# EAGLE schematic openadc_ztex (EAGLE 6.5.0)
Assembly variants: no-adc

## Sheet 1 of 8
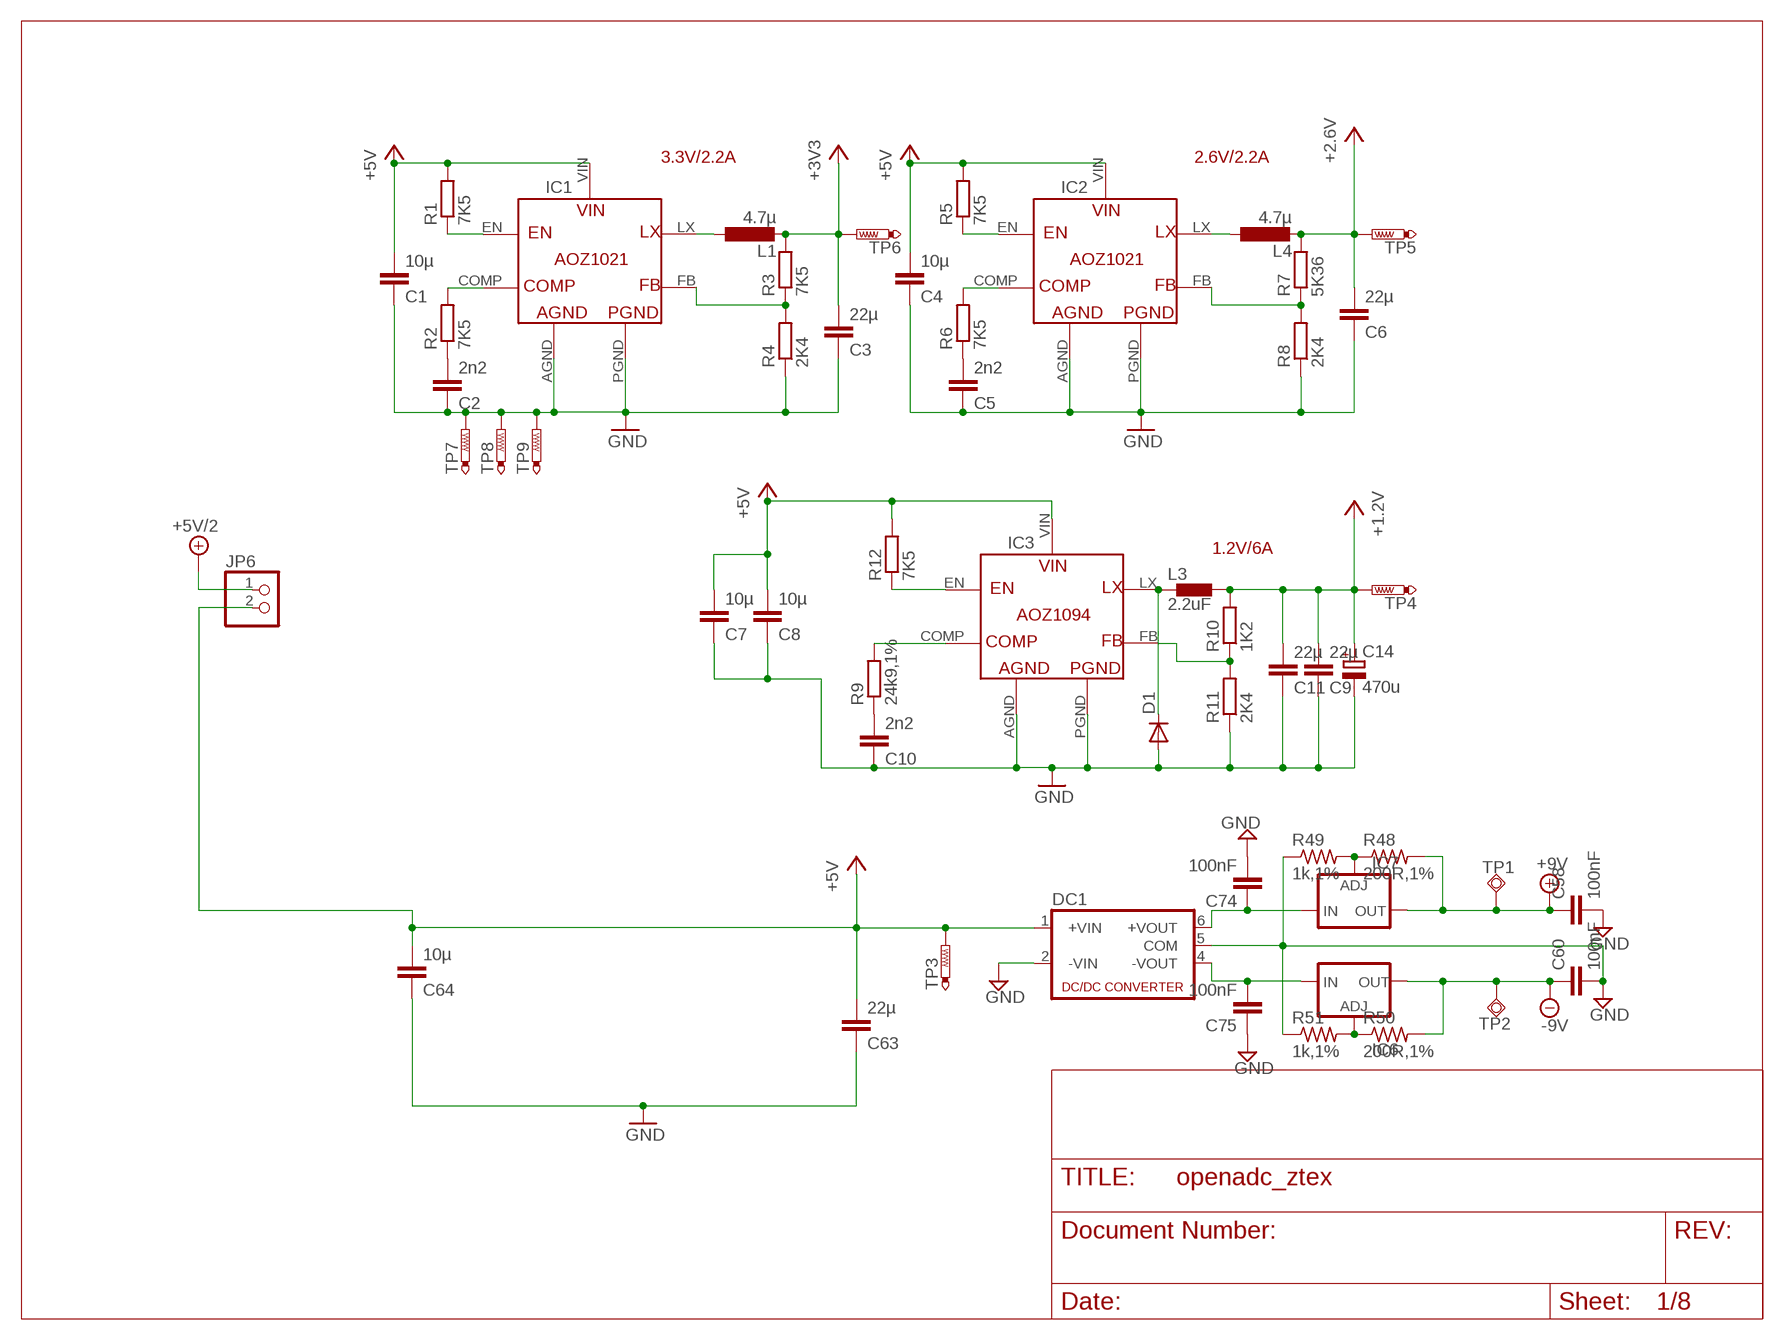
[diagram p0: schematic, sheet 1]

### Parts
C1  10µ  C-EUC1206  [C1206]
C2  2n2  C-EUC0805K  [C0805K]
C3  22µ  C-EUC0805K  [C0805K]
C4  10µ  C-EUC1206  [C1206]
C5  2n2  C-EUC0805K  [C0805K]
C6  22µ  C-EUC0805K  [C0805K]
C7  10µ  C-EUC1206  [C1206]
C8  10µ  C-EUC1206  [C1206]
C9  22µ  C-EUC0805K  [C0805K]
C10  2n2  C-EUC0805K  [C0805K]
C11  22µ  C-EUC0805K  [C0805K]
C14  470u  CPOL-EUE2.5-6  [E2,5-6]
C58  100nF  C-EUC0603  [C0603]
C60  100nF  C-EUC0603  [C0603]
C63  22µ  C-EUC0805K  [C0805K]
C64  10µ  C-EUC1206  [C1206]
C74  100nF  C-EUC0603  [C0603]
C75  100nF  C-EUC0603  [C0603]
D1  DIODE-MELF-MLL41  [MELF-MLL41]
DC1  NMA  [NMA]
IC1  AOZ1021  [AOZ1021]
IC2  AOZ1021  [AOZ1021]
IC3  AOZ1094  [AOZ1094.PAC]
IC6  LM337L  [337L]
IC7  LM317L  [317L]
JP6  PINHD-1X2  [1X02]
L1  4.7µ  L-EUNR60  [NR60]
L3  2.2uF  DR1030FAKE  [DR1030MOD.PAC]
L4  4.7µ  L-EUNR60  [NR60]
R1  7K5  R-EU_R0805K  [R0805K]
R2  7K5  R-EU_R0805K  [R0805K]
R3  7K5  R-EU_R0805K  [R0805K]
R4  2K4  R-EU_R0805K  [R0805K]
R5  7K5  R-EU_R0805K  [R0805K]
R6  7K5  R-EU_R0805K  [R0805K]
R7  5K36  R-EU_R0805K  [R0805K]
R8  2K4  R-EU_R0805K  [R0805K]
R9  24k9,1%  R-EU_R0805K  [R0805K]
R10  1K2  R-EU_R0805K  [R0805K]
R11  2K4  R-EU_R0805K  [R0805K]
R12  7K5  R-EU_R0805K  [R0805K]
R48  200R,1%  R-US_R0603  [R0603]
R49  1k,1%  R-US_R0603  [R0603]
R50  200R,1%  R-US_R0603  [R0603]
R51  1k,1%  R-US_R0603  [R0603]
TP1  TPSQPAD1-13  [P1-13]  (not fitted in variant no-adc)
TP2  TPSQPAD1-13  [P1-13]  (not fitted in variant no-adc)
TP3  PTR1PAD1-13  [P1-13]  (not fitted in variant no-adc)
TP4  PTR1PAD1-13  [P1-13]  (not fitted in variant no-adc)
TP5  PTR1PAD1-13  [P1-13]  (not fitted in variant no-adc)
TP6  PTR1PAD1-13  [P1-13]  (not fitted in variant no-adc)
TP7  PTR1PAD1-13  [P1-13]
TP8  PTR1PAD1-13  [P1-13]
TP9  PTR1PAD1-13  [P1-13]  (not fitted in variant no-adc)

### Nets
+1.2V [xpower]: C9.2 C11.2 C14.+ L3.2 R10.2 TP4.TP ; also sheet 2
+2.6V [power]: C6.2 L4.P$2 R7.2 TP5.TP ; also sheet 2
+3V3 [power]: C3.2 L1.P$2 R3.2 TP6.TP ; also sheet 2,3,5,6,7,8
+5V: C1.2 C4.2 C7.2 C8.2 C63.2 C64.2 DC1.1(+VIN) IC1.VIN IC2.VIN IC3.VIN JP6.2 R1.2 R5.2 R12.2 TP3.TP ; also sheet 2,7,8
+5V/2: JP6.1 ; also sheet 4,7
+9V: C58.1 IC7.2(OUT) R48.2 TP1.TP ; also sheet 7
-9V: C60.1 IC6.OUT R50.2 TP2.TP ; also sheet 7
GND [power]: C1.1 C2.1 C3.1 C4.1 C5.1 C6.1 C7.1 C8.1 C9.1 C10.1 C11.1 C14.- C58.2 C60.2 C63.1 C64.1 C74.2 C75.1 D1.A DC1.2(-VIN) DC1.5(COM) IC1.AGND IC1.PGND IC2.AGND IC2.PGND IC3.AGND IC3.PGND R4.1 R8.1 R11.1 R49.1 R51.1 TP7.TP TP8.TP TP9.TP ; also sheet 2,3,4,5,6,7,8
N$2: IC3.EN R12.1
N$3 [power]: IC1.LX L1.P$1
N$4: IC1.FB R3.1 R4.2
N$5: D1.C IC3.LX L3.1
N$10: IC1.EN R1.1
N$14 [power]: IC3.FB R10.1 R11.2
N$17: C2.2 R2.1
N$33: IC1.COMP R2.2
N$36: C10.2 R9.1
N$37: IC3.COMP R9.2
N$38 [power]: IC2.LX L4.P$1
N$39: IC2.FB R7.1 R8.2
N$41: IC2.EN R5.1
N$42: C5.2 R6.1
N$43: IC2.COMP R6.2
N$82: C74.1 DC1.6(+VOUT) IC7.3(IN)
N$99: C75.2 DC1.4(-VOUT) IC6.IN
N$108: IC6.ADJ R50.1 R51.2
N$109: IC7.1(ADJ) R48.1 R49.2

### Notes on the sheet
- 3.3V/2.2A | 2.6V/2.2A
- 1.2V/6A

## Sheet 2 of 8
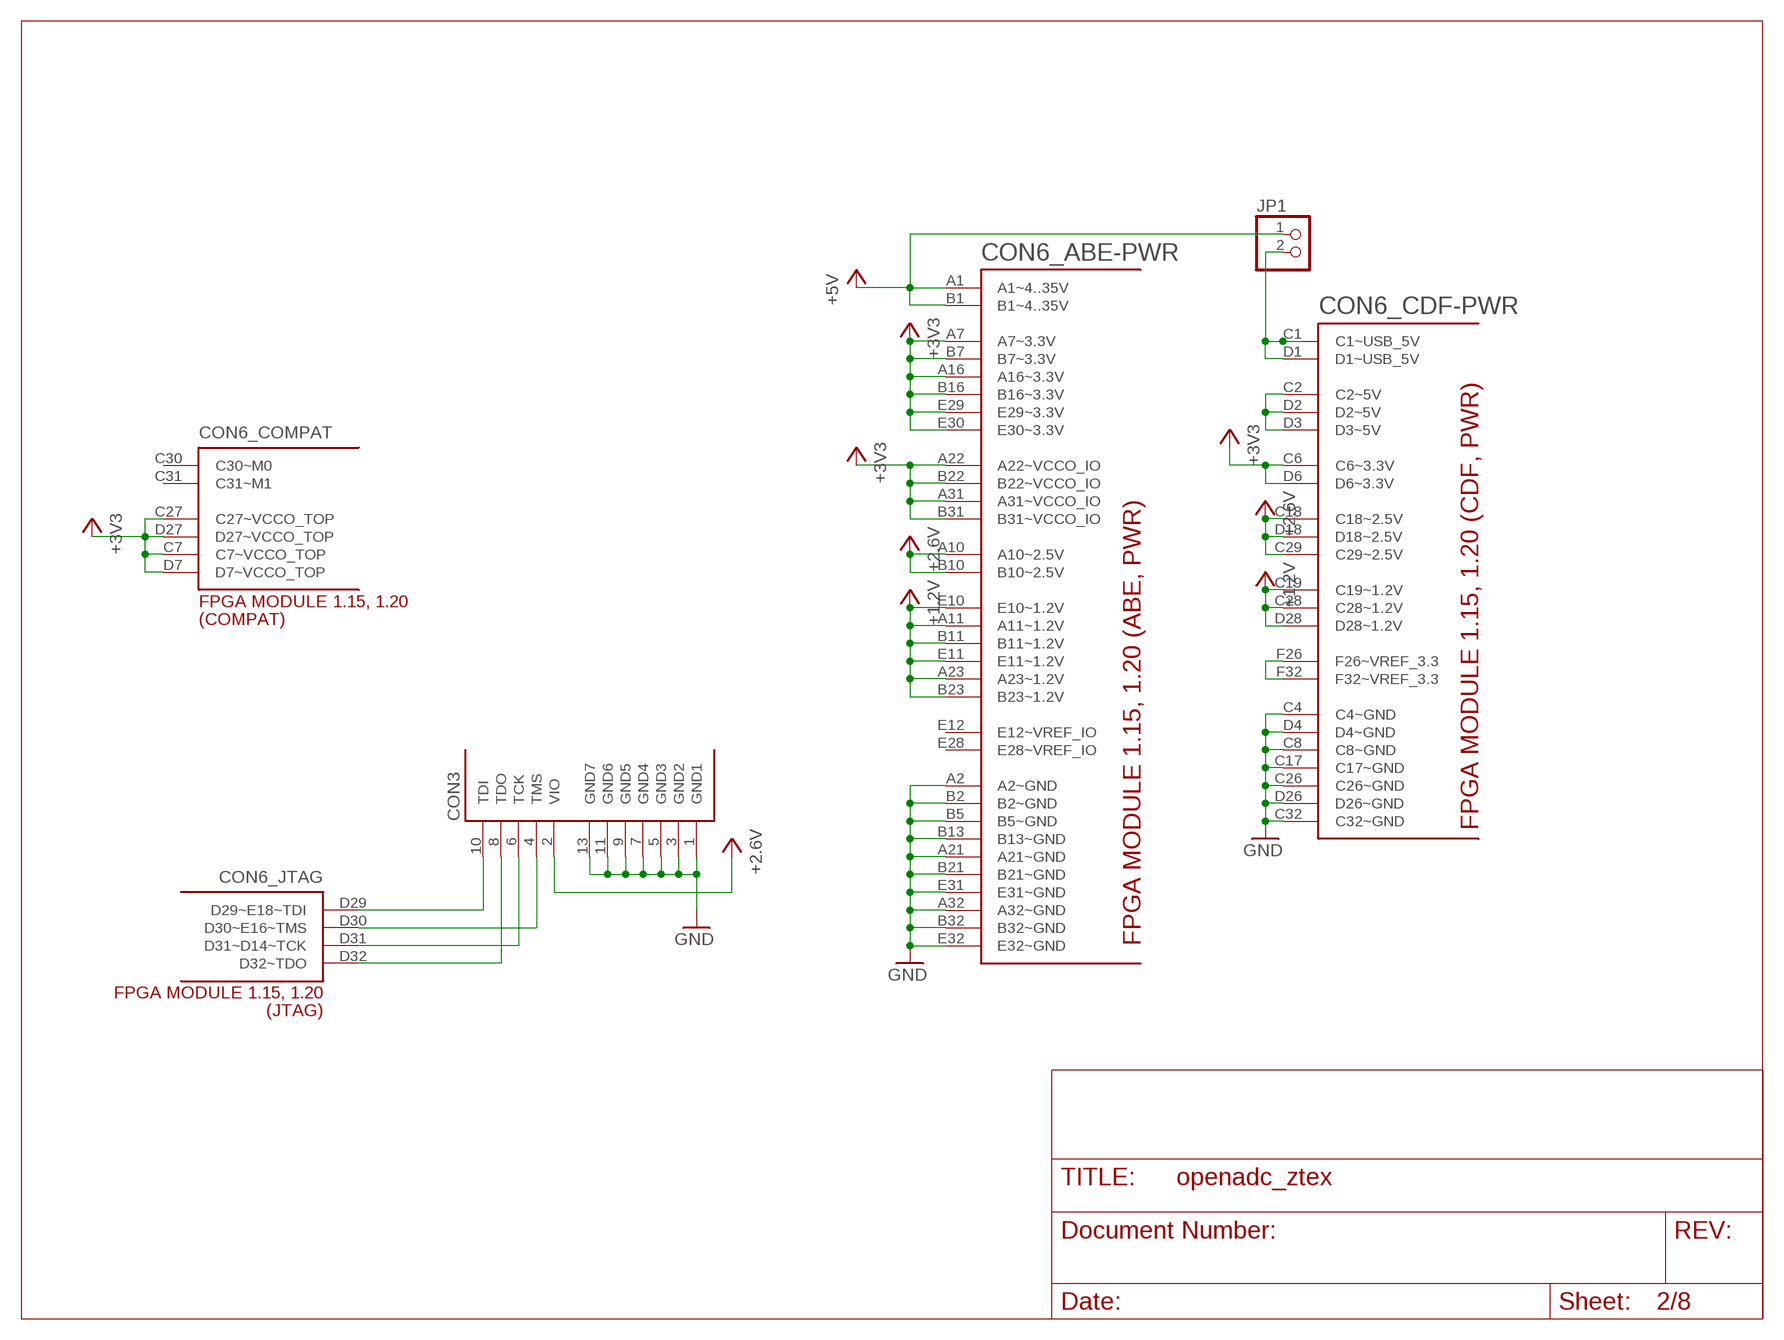
[diagram p1: schematic, sheet 2]

### Parts
CON3  JTAG  [JTAG]
CON6  USB-FPGA1.15  [USB-FPGA1.15]
JP1  PINHD-1X2  [1X02]

### Nets
+1.2V [xpower]: CON6.A11(_ABE-PWR:A11~1.2V) CON6.A23(_ABE-PWR:A23~1.2V) CON6.B11(_ABE-PWR:B11~1.2V) CON6.B23(_ABE-PWR:B23~1.2V) CON6.C19(_CDF-PWR:C19~1.2V) CON6.C28(_CDF-PWR:C28~1.2V) CON6.D28(_CDF-PWR:D28~1.2V) CON6.E10(_ABE-PWR:E10~1.2V) CON6.E11(_ABE-PWR:E11~1.2V) ; also sheet 1
+2.6V [power]: CON3.2(VIO) CON6.A10(_ABE-PWR:A10~2.5V) CON6.B10(_ABE-PWR:B10~2.5V) CON6.C18(_CDF-PWR:C18~2.5V) CON6.C29(_CDF-PWR:C29~2.5V) CON6.D18(_CDF-PWR:D18~2.5V) ; also sheet 1
+3V3 [power]: CON6.A7(_ABE-PWR:A7~3.3V) CON6.A16(_ABE-PWR:A16~3.3V) CON6.A22(_ABE-PWR:A22~VCCO_IO) CON6.A31(_ABE-PWR:A31~VCCO_IO) CON6.B7(_ABE-PWR:B7~3.3V) CON6.B16(_ABE-PWR:B16~3.3V) CON6.B22(_ABE-PWR:B22~VCCO_IO) CON6.B31(_ABE-PWR:B31~VCCO_IO) CON6.C6(_CDF-PWR:C6~3.3V) CON6.C7(_COMPAT:C7~VCCO_TOP) CON6.C27(_COMPAT:C27~VCCO_TOP) CON6.D6(_CDF-PWR:D6~3.3V) CON6.D7(_COMPAT:D7~VCCO_TOP) CON6.D27(_COMPAT:D27~VCCO_TOP) CON6.E29(_ABE-PWR:E29~3.3V) CON6.E30(_ABE-PWR:E30~3.3V) ; also sheet 1,3,5,6,7,8
+5V: CON6.A1(_ABE-PWR:A1~4..35V) CON6.B1(_ABE-PWR:B1~4..35V) JP1.1 ; also sheet 1,7,8
GND [power]: CON3.1(GND1) CON3.3(GND2) CON3.5(GND3) CON3.7(GND4) CON3.9(GND5) CON3.11(GND6) CON3.13(GND7) CON6.A2(_ABE-PWR:A2~GND) CON6.A21(_ABE-PWR:A21~GND) CON6.A32(_ABE-PWR:A32~GND) CON6.B2(_ABE-PWR:B2~GND) CON6.B5(_ABE-PWR:B5~GND) CON6.B13(_ABE-PWR:B13~GND) CON6.B21(_ABE-PWR:B21~GND) CON6.B32(_ABE-PWR:B32~GND) CON6.C4(_CDF-PWR:C4~GND) CON6.C8(_CDF-PWR:C8~GND) CON6.C17(_CDF-PWR:C17~GND) CON6.C26(_CDF-PWR:C26~GND) CON6.C32(_CDF-PWR:C32~GND) CON6.D4(_CDF-PWR:D4~GND) CON6.D26(_CDF-PWR:D26~GND) CON6.E31(_ABE-PWR:E31~GND) CON6.E32(_ABE-PWR:E32~GND) ; also sheet 1,3,4,5,6,7,8
N$13: CON6.C1(_CDF-PWR:C1~USB_5V) CON6.D1(_CDF-PWR:D1~USB_5V) JP1.2
N$15: CON6.C2(_CDF-PWR:C2~5V) CON6.D2(_CDF-PWR:D2~5V) CON6.D3(_CDF-PWR:D3~5V)
N$20: CON6.F26(_CDF-PWR:F26~VREF_3.3) CON6.F32(_CDF-PWR:F32~VREF_3.3)
N$23: CON3.8(TDO) CON6.D32(_JTAG:D32~TDO)
N$24: CON3.10(TDI) CON6.D29(_JTAG:D29~E18~TDI)
N$25: CON3.6(TCK) CON6.D31(_JTAG:D31~D14~TCK)
N$26: CON3.4(TMS) CON6.D30(_JTAG:D30~E16~TMS)
Unconnected: CON6.A3(_ABE-FX2:A3~INT4) CON6.A4(_ABE-FX2:A4~T1) CON6.A5(_ABE-FX2:A5~BKPT) CON6.A6(_ABE-FX2:A6~SCL) CON6.A8(_ABE-FX2:A8~TXD0) CON6.B3(_ABE-FX2:B3~T0) CON6.B4(_ABE-FX2:B4~T2) CON6.B6(_ABE-FX2:B6~SDA) CON6.B8(_ABE-FX2:B8~RXD0) CON6.C5(_CDF-FX2:C5~INT5#) CON6.C9(_CDF-FX2:C9~PE7/GPIFADR8) CON6.C10(_CDF-FX2:C10~PE6/T2EX) CON6.C11(_CDF-FX2:C11~PE5/INT6) CON6.C12(_CDF-FX2:C12~PE4/RXD1OUT) CON6.C13(_CDF-FX2:C13~PE3/RXD0OUT) CON6.C14(_CDF-FX2:C14~PE2/T2OUT) CON6.C15(_CDF-FX2:C15~PE1/T1OUT) CON6.C16(_CDF-FX2:C16~PE0/T0OUT) CON6.C30(_COMPAT:C30~M0) CON6.C31(_COMPAT:C31~M1) CON6.D5(_CDF-FX2:D5~WAKEUP*) CON6.E12(_ABE-PWR:E12~VREF_IO) CON6.E28(_ABE-PWR:E28~VREF_IO)

## Sheet 3 of 8
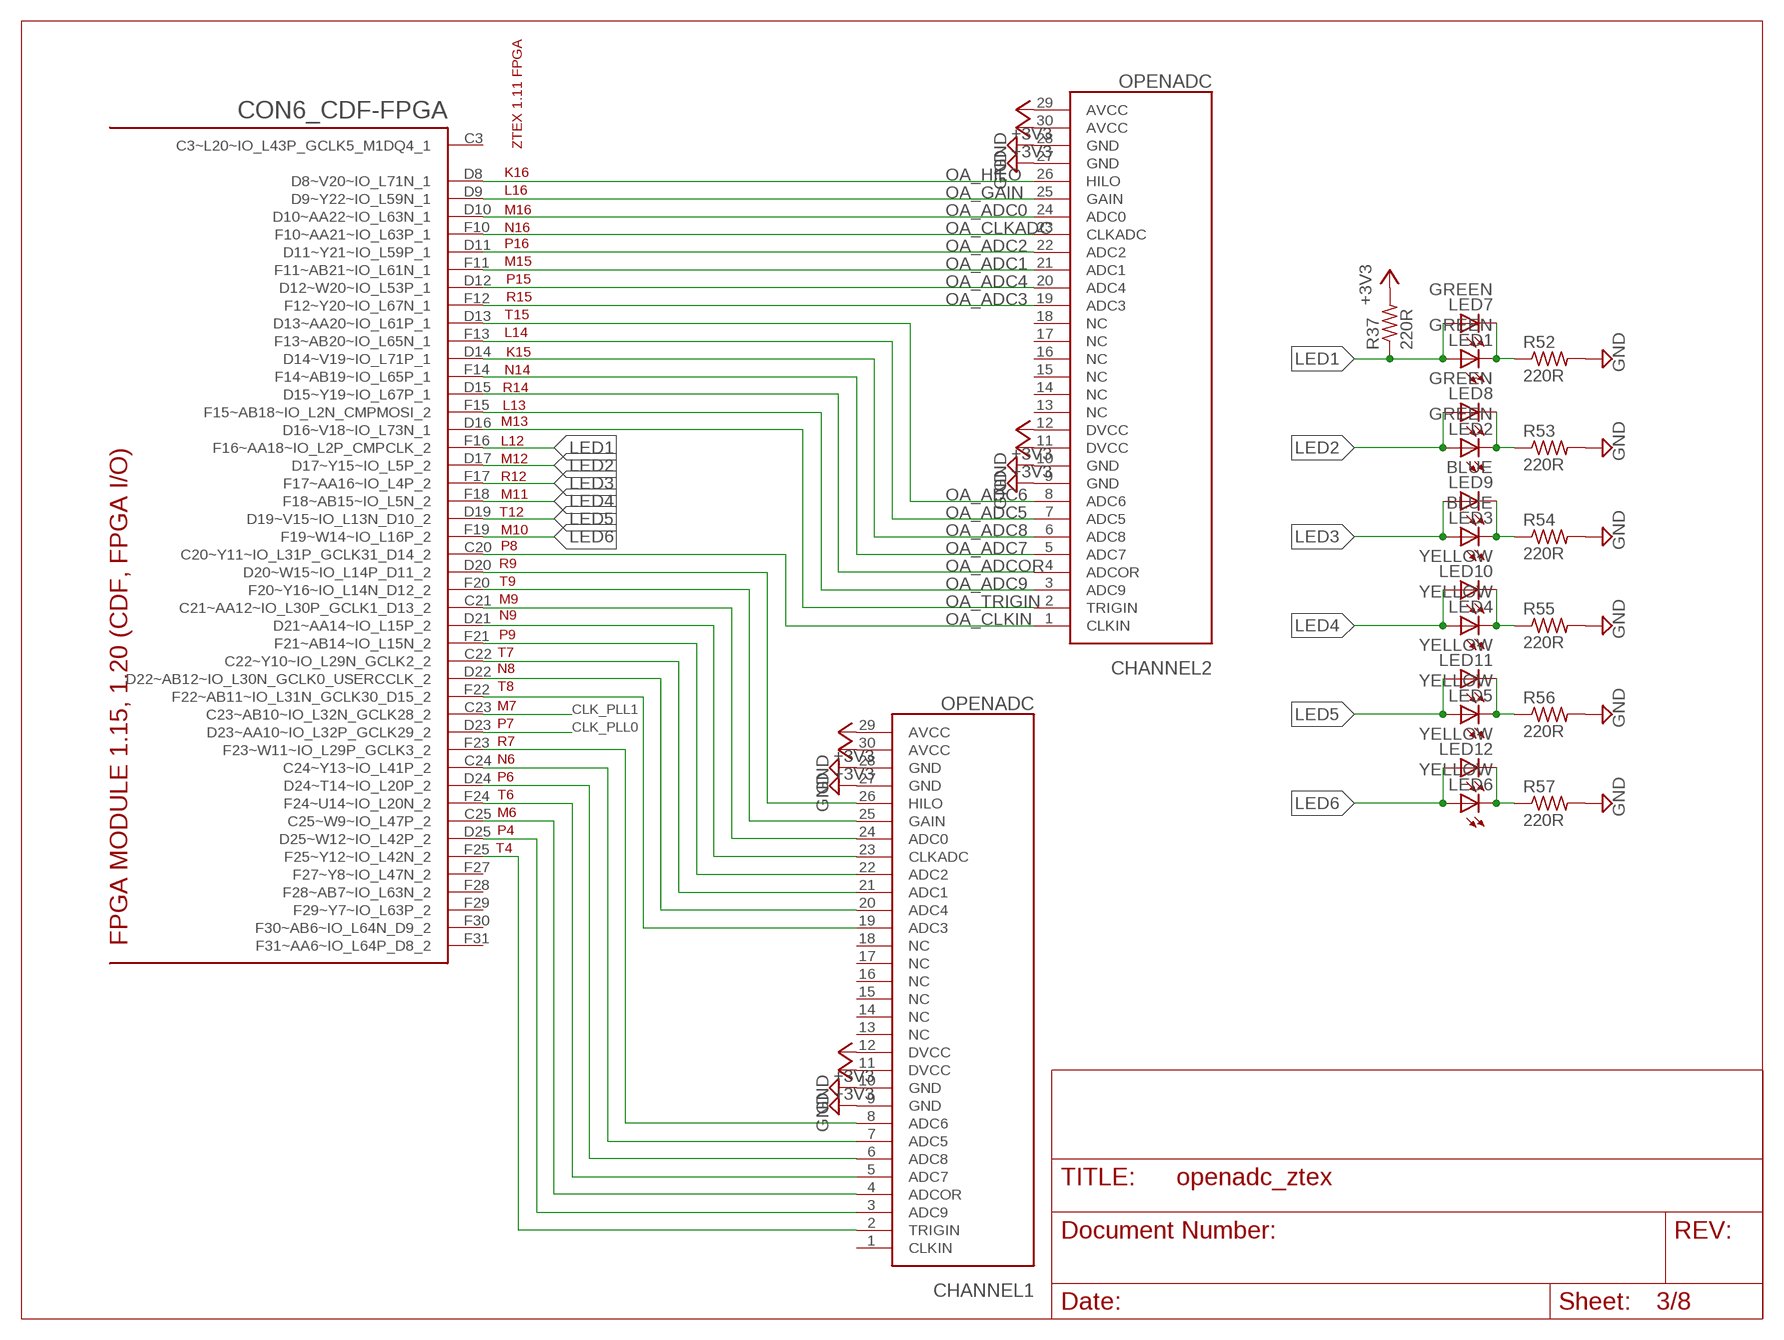
[diagram p2: schematic, sheet 3]

### Parts
CHANNEL1  OPENADC  [OPENADCREV1]
CHANNEL2  OPENADC  [OPENADCREV1]
LED1  GREEN  LED-0805  [LED-805]
LED2  GREEN  LED-0805  [LED-805]
LED3  BLUE  LED-0805  [LED-805]
LED4  YELLOW  LED-0805  [LED-805]
LED5  YELLOW  LED-0805  [LED-805]
LED6  YELLOW  LED-0805  [LED-805]
LED7  GREEN  LED-0805  [LED-805]
LED8  GREEN  LED-0805  [LED-805]
LED9  BLUE  LED-0805  [LED-805]
LED10  YELLOW  LED-0805  [LED-805]
LED11  YELLOW  LED-0805  [LED-805]
LED12  YELLOW  LED-0805  [LED-805]
R37  220R  R-US_R0603  [R0603]
R52  220R  R-US_R0603  [R0603]
R53  220R  R-US_R0603  [R0603]
R54  220R  R-US_R0603  [R0603]
R55  220R  R-US_R0603  [R0603]
R56  220R  R-US_R0603  [R0603]
R57  220R  R-US_R0603  [R0603]

### Nets
+3V3 [power]: CHANNEL1.11(DVCC) CHANNEL1.12(DVCC) CHANNEL1.29(AVCC) CHANNEL1.30(AVCC) CHANNEL2.11(DVCC) CHANNEL2.12(DVCC) CHANNEL2.29(AVCC) CHANNEL2.30(AVCC) R37.2 ; also sheet 1,2,5,6,7,8
CLK_PLL0: CON6.D23(_CDF-FPGA:D23~AA10~IO_L32P_GCLK29_2) ; also sheet 7
CLK_PLL1: CON6.C23(_CDF-FPGA:C23~AB10~IO_L32N_GCLK28_2) ; also sheet 7
GND [power]: CHANNEL1.9(GND) CHANNEL1.10(GND) CHANNEL1.27(GND) CHANNEL1.28(GND) CHANNEL2.9(GND) CHANNEL2.10(GND) CHANNEL2.27(GND) CHANNEL2.28(GND) R52.2 R53.2 R54.2 R55.2 R56.2 R57.2 ; also sheet 1,2,4,5,6,7,8
LED1: CON6.F16(_CDF-FPGA:F16~AA18~IO_L2P_CMPCLK_2) LED1.A LED7.A R37.1
LED2: CON6.D17(_CDF-FPGA:D17~Y15~IO_L5P_2) LED2.A LED8.A
LED3: CON6.F17(_CDF-FPGA:F17~AA16~IO_L4P_2) LED3.A LED9.A
LED4: CON6.F18(_CDF-FPGA:F18~AB15~IO_L5N_2) LED4.A LED10.A
LED5: CON6.D19(_CDF-FPGA:D19~V15~IO_L13N_D10_2) LED5.A LED11.A
LED6: CON6.F19(_CDF-FPGA:F19~W14~IO_L16P_2) LED6.A LED12.A
N$32: CHANNEL1.21(ADC1) CON6.C22(_CDF-FPGA:C22~Y10~IO_L29N_GCLK2_2)
N$34: CHANNEL1.26(HILO) CON6.D20(_CDF-FPGA:D20~W15~IO_L14P_D11_2)
N$35: CHANNEL1.20(ADC4) CON6.D22(_CDF-FPGA:D22~AB12~IO_L30N_GCLK0_USERCCLK_2)
N$40: CHANNEL1.25(GAIN) CON6.F20(_CDF-FPGA:F20~Y16~IO_L14N_D12_2)
N$44: CHANNEL1.24(ADC0) CON6.C21(_CDF-FPGA:C21~AA12~IO_L30P_GCLK1_D13_2)
N$45: CHANNEL1.23(CLKADC) CON6.D21(_CDF-FPGA:D21~AA14~IO_L15P_2)
N$46: CHANNEL1.22(ADC2) CON6.F21(_CDF-FPGA:F21~AB14~IO_L15N_2)
N$47: CHANNEL1.19(ADC3) CON6.F22(_CDF-FPGA:F22~AB11~IO_L31N_GCLK30_D15_2)
N$48: CHANNEL1.8(ADC6) CON6.F23(_CDF-FPGA:F23~W11~IO_L29P_GCLK3_2)
N$49: CHANNEL1.7(ADC5) CON6.C24(_CDF-FPGA:C24~Y13~IO_L41P_2)
N$50: CHANNEL1.6(ADC8) CON6.D24(_CDF-FPGA:D24~T14~IO_L20P_2)
N$51: CHANNEL1.5(ADC7) CON6.F24(_CDF-FPGA:F24~U14~IO_L20N_2)
N$52: CHANNEL1.4(ADCOR) CON6.C25(_CDF-FPGA:C25~W9~IO_L47P_2)
N$53: CHANNEL1.3(ADC9) CON6.D25(_CDF-FPGA:D25~W12~IO_L42P_2)
N$54: CHANNEL1.2(TRIGIN) CON6.F25(_CDF-FPGA:F25~Y12~IO_L42N_2)
N$110: LED1.C LED7.C R52.1
N$111: LED2.C LED8.C R53.1
N$112: LED3.C LED9.C R54.1
N$113: LED4.C LED10.C R55.1
N$114: LED5.C LED11.C R56.1
N$115: LED6.C LED12.C R57.1
OA_ADC0: CHANNEL2.24(ADC0) CON6.D10(_CDF-FPGA:D10~AA22~IO_L63N_1) ; also sheet 5
OA_ADC1: CHANNEL2.21(ADC1) CON6.F11(_CDF-FPGA:F11~AB21~IO_L61N_1) ; also sheet 5
OA_ADC2: CHANNEL2.22(ADC2) CON6.D11(_CDF-FPGA:D11~Y21~IO_L59P_1) ; also sheet 5
OA_ADC3: CHANNEL2.19(ADC3) CON6.F12(_CDF-FPGA:F12~Y20~IO_L67N_1) ; also sheet 5
OA_ADC4: CHANNEL2.20(ADC4) CON6.D12(_CDF-FPGA:D12~W20~IO_L53P_1) ; also sheet 5
OA_ADC5: CHANNEL2.7(ADC5) CON6.F13(_CDF-FPGA:F13~AB20~IO_L65N_1) ; also sheet 5
OA_ADC6: CHANNEL2.8(ADC6) CON6.D13(_CDF-FPGA:D13~AA20~IO_L61P_1) ; also sheet 5
OA_ADC7: CHANNEL2.5(ADC7) CON6.F14(_CDF-FPGA:F14~AB19~IO_L65P_1) ; also sheet 5
OA_ADC8: CHANNEL2.6(ADC8) CON6.D14(_CDF-FPGA:D14~V19~IO_L71P_1) ; also sheet 5
OA_ADC9: CHANNEL2.3(ADC9) CON6.F15(_CDF-FPGA:F15~AB18~IO_L2N_CMPMOSI_2) ; also sheet 5
OA_ADCOR: CHANNEL2.4(ADCOR) CON6.D15(_CDF-FPGA:D15~Y19~IO_L67P_1) ; also sheet 5
OA_CLKADC: CHANNEL2.23(CLKADC) CON6.F10(_CDF-FPGA:F10~AA21~IO_L63P_1) ; also sheet 5
OA_CLKIN: CHANNEL2.1(CLKIN) CON6.C20(_CDF-FPGA:C20~Y11~IO_L31P_GCLK31_D14_2) ; also sheet 6
OA_GAIN: CHANNEL2.25(GAIN) CON6.D9(_CDF-FPGA:D9~Y22~IO_L59N_1) ; also sheet 5
OA_HILO: CHANNEL2.26(HILO) CON6.D8(_CDF-FPGA:D8~V20~IO_L71N_1) ; also sheet 5
OA_TRIGIN: CHANNEL2.2(TRIGIN) CON6.D16(_CDF-FPGA:D16~V18~IO_L73N_1)
Unconnected: CHANNEL1.1(CLKIN) CHANNEL1.13(NC) CHANNEL1.14(NC) CHANNEL1.15(NC) CHANNEL1.16(NC) CHANNEL1.17(NC) CHANNEL1.18(NC) CHANNEL2.13(NC) CHANNEL2.14(NC) CHANNEL2.15(NC) CHANNEL2.16(NC) CHANNEL2.17(NC) CHANNEL2.18(NC) CON6.C3(_CDF-FPGA:C3~L20~IO_L43P_GCLK5_M1DQ4_1) CON6.F27(_CDF-FPGA:F27~Y8~IO_L47N_2) CON6.F28(_CDF-FPGA:F28~AB7~IO_L63N_2) CON6.F29(_CDF-FPGA:F29~Y7~IO_L63P_2) CON6.F30(_CDF-FPGA:F30~AB6~IO_L64N_D9_2) CON6.F31(_CDF-FPGA:F31~AA6~IO_L64P_D8_2)

### Notes on the sheet
- ZTEX 1.11 FPGA
- K16
- L16
- M16
- N16
- P16
- M15
- P15
- R15
- T15
- L14
- K15
- N14
- R14
- L13
- M13
- L12
- M12
- R12
- M11
- T12
- M10
- P8
- R9
- T9
- M9
- N9
- P9
- T7
- N8
- T8
- M7
- P7
- R7
- N6
- P6
- T6
- M6
- P4
- T4

## Sheet 4 of 8
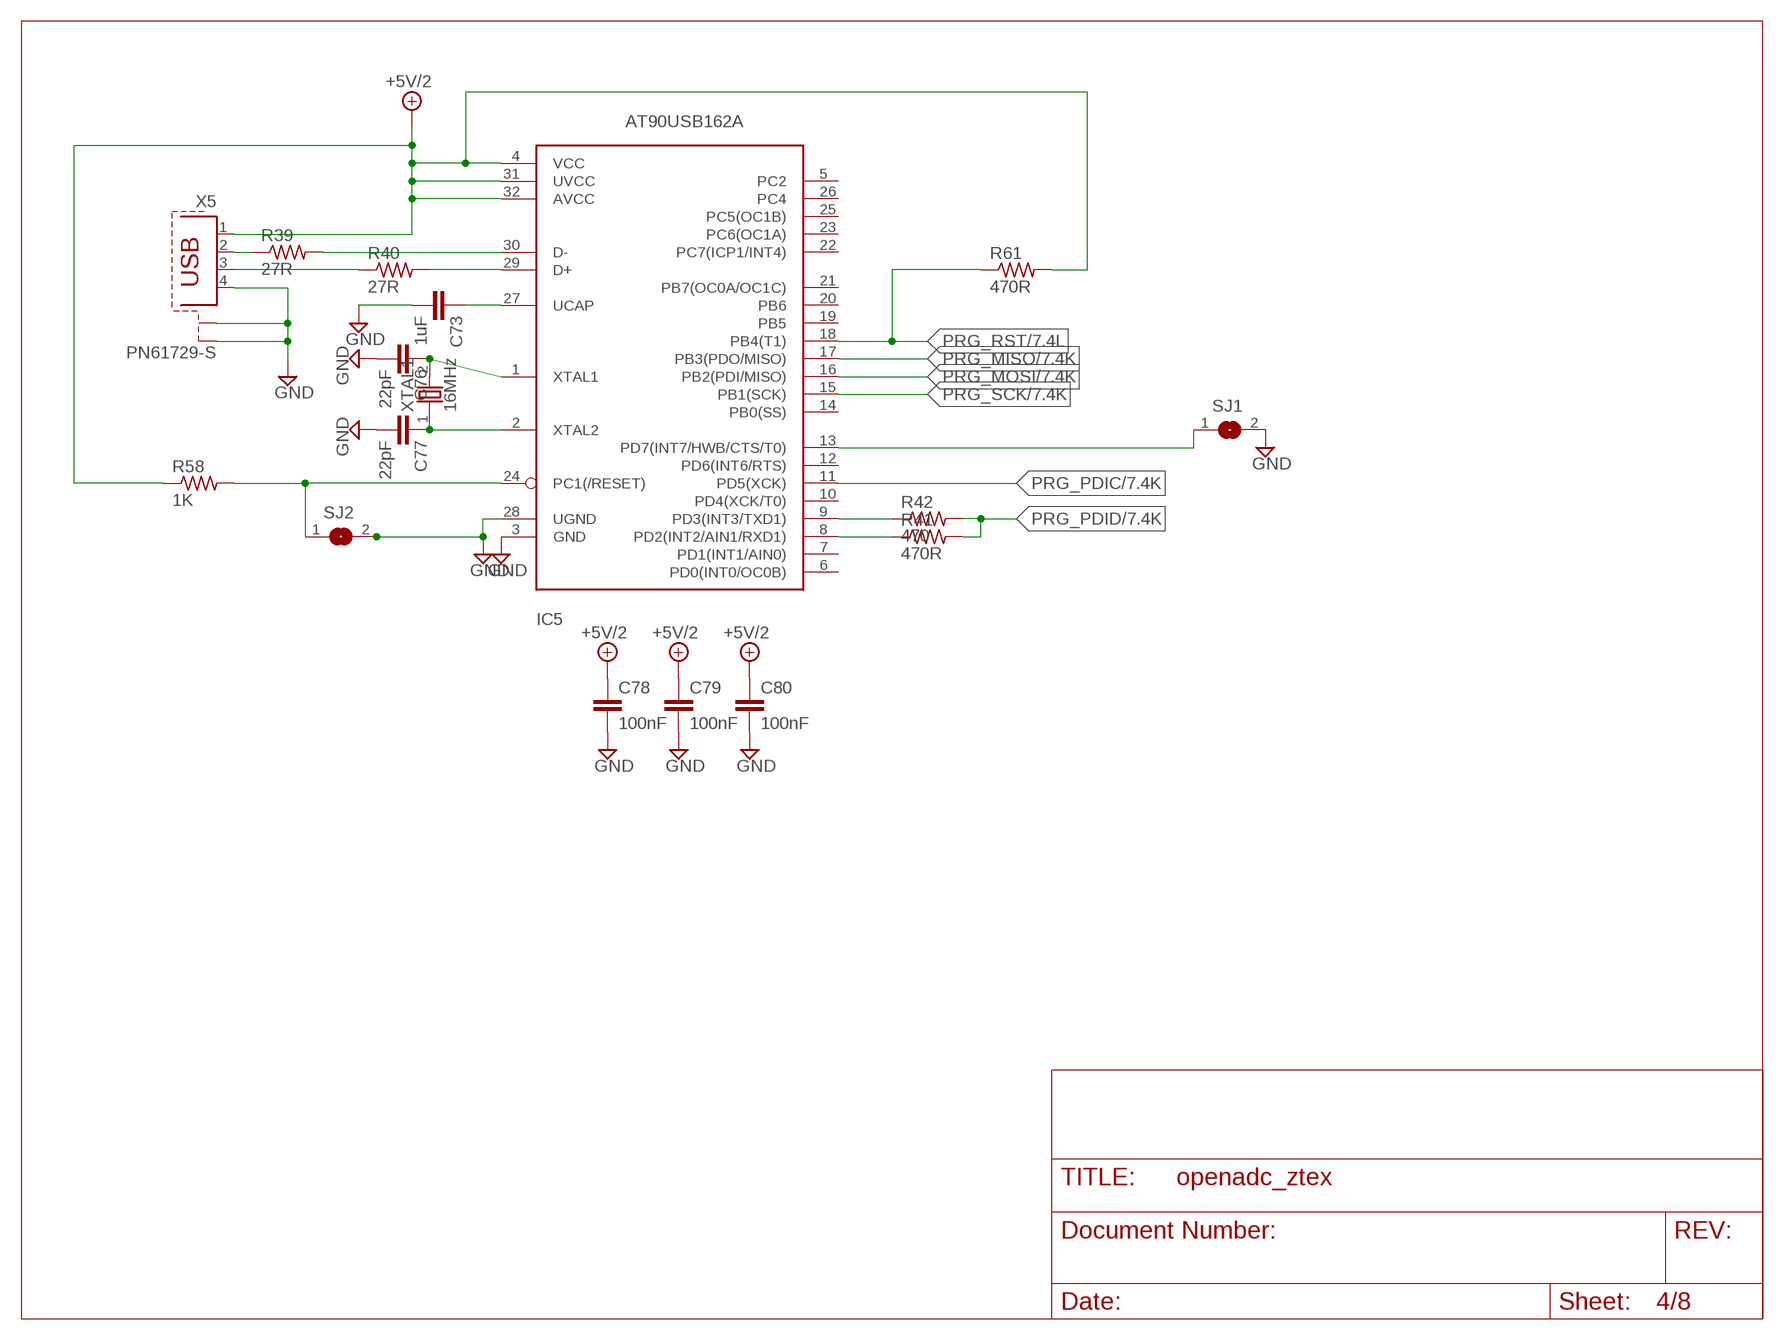
[diagram p3: schematic, sheet 4]

### Parts
C73  1uF  C-EUC0603  [C0603]
C76  22pF  C-EUC0603  [C0603]
C77  22pF  C-EUC0603  [C0603]
C78  100nF  C-EUC0603  [C0603]
C79  100nF  C-EUC0603  [C0603]
C80  100nF  C-EUC0603  [C0603]
IC5  AT90USB162A  [TQFP32-08]
R39  27R  R-US_R0603  [R0603]
R40  27R  R-US_R0603  [R0603]
R41  470R  R-US_R0603  [R0603]
R42  470  R-US_R0603  [R0603]
R58  1K  R-US_R0603  [R0603]
R61  470R  R-US_R0603  [R0603]
SJ1  SJ  [SJ]
SJ2  SJ  [SJ]
X5  PN61729-S  [PN61729-S]
XTAL1  16MHz  OSC-XTAL-HC-49U-SMD  [HC-49U]

### Nets
+5V/2: C78.1 C79.1 C80.1 IC5.4(VCC) IC5.31(UVCC) IC5.32(AVCC) R58.1 R61.2 X5.1 ; also sheet 1,7
GND [power]: C73.2 C76.2 C77.2 C78.2 C79.2 C80.2 IC5.3(GND) IC5.28(UGND) SJ1.2 SJ2.2 X5.4 X5.S1 X5.S2 ; also sheet 1,2,3,5,6,7,8
N$88: IC5.30(D-) R39.2
N$102: IC5.29(D+) R40.2
N$103: R40.1 X5.3
N$104: R39.1 X5.2
N$105: IC5.9(PD3(INT3/TXD1)) R42.1
N$106: C73.1 IC5.27(UCAP)
N$107: IC5.8(PD2(INT2/AIN1/RXD1)) R41.1
N$116: C76.1 IC5.1(XTAL1) XTAL1.2
N$117: C77.1 IC5.2(XTAL2) XTAL1.1
N$122: IC5.13(PD7(INT7/HWB/CTS/T0)) SJ1.1
N$123: IC5.24(PC1(/RESET)) R58.2 SJ2.1
PRG_MISO: IC5.17(PB3(PDO/MISO)) ; also sheet 7
PRG_MOSI: IC5.16(PB2(PDI/MISO)) ; also sheet 7
PRG_PDIC: IC5.11(PD5(XCK)) ; also sheet 7
PRG_PDID: R41.2 R42.2 ; also sheet 7
PRG_RST: IC5.18(PB4(T1)) R61.1 ; also sheet 7
PRG_SCK: IC5.15(PB1(SCK)) ; also sheet 7
Unconnected: IC5.5(PC2) IC5.6(PD0(INT0/OC0B)) IC5.7(PD1(INT1/AIN0)) IC5.10(PD4(XCK/T0)) IC5.12(PD6(INT6/RTS)) IC5.14(PB0(SS)) IC5.19(PB5) IC5.20(PB6) IC5.21(PB7(OC0A/OC1C)) IC5.22(PC7(ICP1/INT4)) IC5.23(PC6(OC1A)) IC5.25(PC5(OC1B)) IC5.26(PC4)

## Sheet 5 of 8
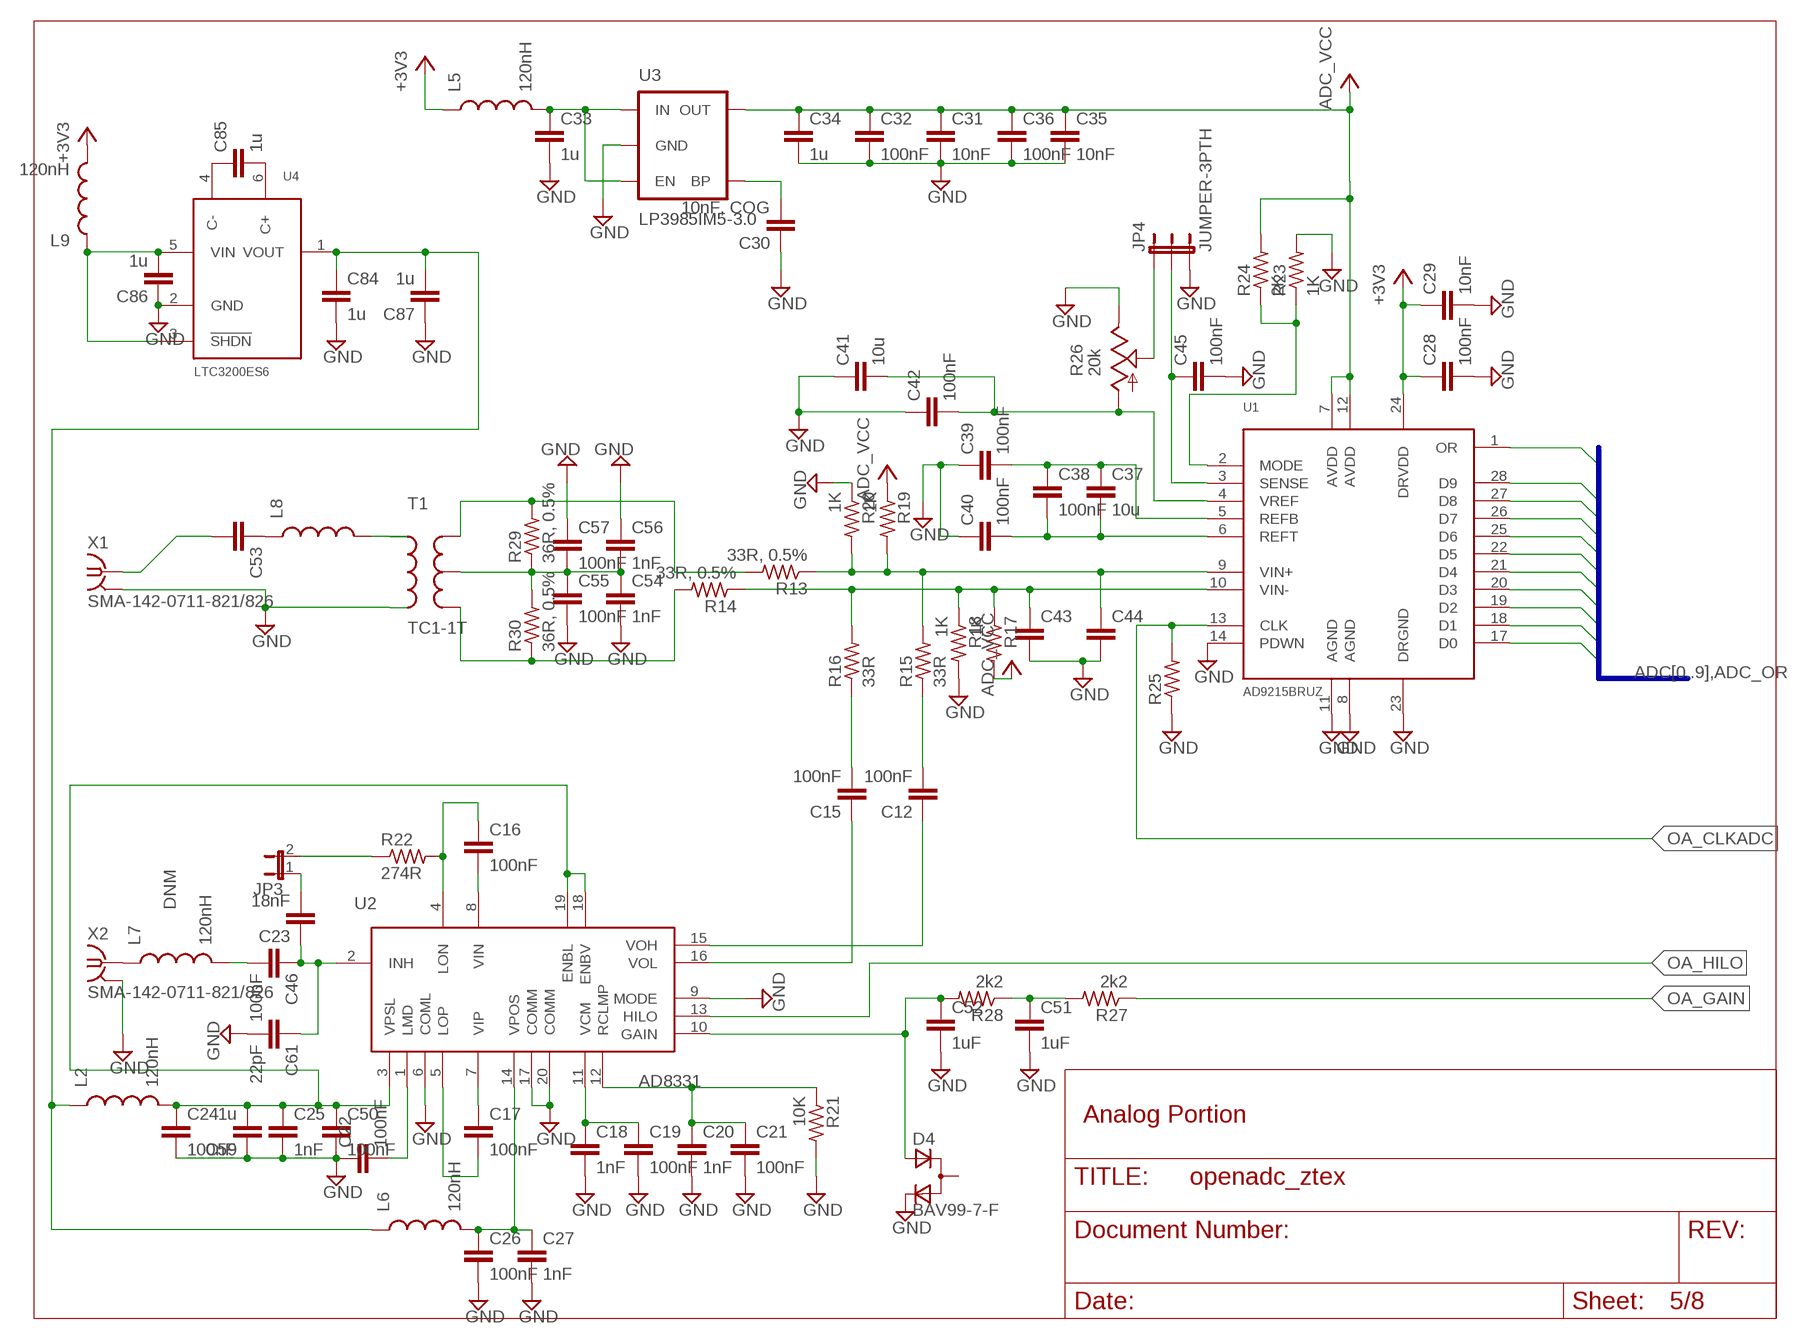
[diagram p4: schematic, sheet 5]

### Parts
C12  100nF  C-EUC0603K  [C0603K]  (not fitted in variant no-adc)
C15  100nF  C-EUC0603K  [C0603K]  (not fitted in variant no-adc)
C16  100nF  C-EUC0402  [C0402]  (not fitted in variant no-adc)
C17  100nF  C-EUC0402  [C0402]  (not fitted in variant no-adc)
C18  1nF  C-EUC0402  [C0402]  (not fitted in variant no-adc)
C19  100nF  C-EUC0402  [C0402]  (not fitted in variant no-adc)
C20  1nF  C-EUC0402  [C0402]  (not fitted in variant no-adc)
C21  100nF  C-EUC0402  [C0402]  (not fitted in variant no-adc)
C22  100nF  C-EUC0402  [C0402]  (not fitted in variant no-adc)
C23  18nF  C-EUC0603  [C0603]  (not fitted in variant no-adc)
C24  100nF  C-EUC0402  [C0402]  (not fitted in variant no-adc)
C25  1nF  C-EUC0402  [C0402]  (not fitted in variant no-adc)
C26  100nF  C-EUC0402  [C0402]  (not fitted in variant no-adc)
C27  1nF  C-EUC0402  [C0402]  (not fitted in variant no-adc)
C28  100nF  C-EUC0402  [C0402]  (not fitted in variant no-adc)
C29  10nF  C-EUC0402  [C0402]  (not fitted in variant no-adc)
C30  10nF, COG  C-EUC0402  [C0402]  (not fitted in variant no-adc)
C31  10nF  C-EUC0402  [C0402]  (not fitted in variant no-adc)
C32  100nF  C-EUC0402  [C0402]  (not fitted in variant no-adc)
C33  1u  C-EUC0603  [C0603]  (not fitted in variant no-adc)
C34  1u  C-EUC0603  [C0603]  (not fitted in variant no-adc)
C35  10nF  C-EUC0402  [C0402]  (not fitted in variant no-adc)
C36  100nF  C-EUC0402  [C0402]  (not fitted in variant no-adc)
C37  10u  C-EUC0603  [C0603]  (not fitted in variant no-adc)
C38  100nF  C-EUC0402  [C0402]  (not fitted in variant no-adc)
C39  100nF  C-EUC0402  [C0402]  (not fitted in variant no-adc)
C40  100nF  C-EUC0402  [C0402]  (not fitted in variant no-adc)
C41  10u  C-EUC0603  [C0603]  (not fitted in variant no-adc)
C42  100nF  C-EUC0402  [C0402]  (not fitted in variant no-adc)
C43  C-EUC0402  [C0402]  (not fitted in variant no-adc)
C44  C-EUC0402  [C0402]  (not fitted in variant no-adc)
C45  100nF  C-EUC0402  [C0402]  (not fitted in variant no-adc)
C46  100nF  C-EUC0603K  [C0603K]  (not fitted in variant no-adc)
C50  100nF  C-EUC0402  [C0402]  (not fitted in variant no-adc)
C51  1uF  C-EUC0603  [C0603]  (not fitted in variant no-adc)
C52  1uF  C-EUC0603  [C0603]  (not fitted in variant no-adc)
C53  C-EUC0603K  [C0603K]  (not fitted in variant no-adc)
C54  1nF  C-EUC0402  [C0402]  (not fitted in variant no-adc)
C55  100nF  C-EUC0402  [C0402]  (not fitted in variant no-adc)
C56  1nF  C-EUC0402  [C0402]  (not fitted in variant no-adc)
C57  100nF  C-EUC0402  [C0402]  (not fitted in variant no-adc)
C59  1u  C-EUC0402  [C0402]  (not fitted in variant no-adc)
C61  22pF  C-EUC0603  [C0603]  (not fitted in variant no-adc)
C84  1u  C-EUC0603  [C0603]  (not fitted in variant no-adc)
C85  1u  C-EUC0603  [C0603]  (not fitted in variant no-adc)
C86  1u  C-EUC0603  [C0603]  (not fitted in variant no-adc)
C87  1u  C-EUC0603  [C0603]  (not fitted in variant no-adc)
D4  BAV99-7-F  D_ACACSOT23  [SOT-23]  (not fitted in variant no-adc)
JP3  JUMPER-2SMD-NC  [SJ_2S]  (not fitted in variant no-adc)
JP4  JUMPER-3PTH  [1X03]  (not fitted in variant no-adc)
L2  120nH  INDUCTOR0603  [0603]  (not fitted in variant no-adc)
L5  120nH  INDUCTOR0603  [0603]  (not fitted in variant no-adc)
L6  120nH  INDUCTOR0603  [0603]  (not fitted in variant no-adc)
L7  120nH  INDUCTOR0603  [0603]  (not fitted in variant no-adc)
L8  INDUCTOR0603  [0603]  (not fitted in variant no-adc)
L9  120nH  INDUCTOR0603  [0603]  (not fitted in variant no-adc)
R13  33R, 0.5%  R-US_R0603  [R0603]  (not fitted in variant no-adc)
R14  33R, 0.5%  R-US_R0603  [R0603]  (not fitted in variant no-adc)
R15  33R  R-US_R0603  [R0603]  (not fitted in variant no-adc)
R16  33R  R-US_R0603  [R0603]  (not fitted in variant no-adc)
R17  1K  R-US_R0402  [R0402]  (not fitted in variant no-adc)
R18  1K  R-US_R0402  [R0402]  (not fitted in variant no-adc)
R19  1K  R-US_R0402  [R0402]  (not fitted in variant no-adc)
R20  1K  R-US_R0402  [R0402]  (not fitted in variant no-adc)
R21  10K  R-US_R0603  [R0603]  (not fitted in variant no-adc)
R22  274R  R-US_R0603  [R0603]  (not fitted in variant no-adc)
R23  1K  R-US_R0402  [R0402]  (not fitted in variant no-adc)
R24  2K  R-US_R0603  [R0603]  (not fitted in variant no-adc)
R25  R-US_R0603  [R0603]  (not fitted in variant no-adc)
R26  20k  TRIM_US-3361P  [3361P]  (not fitted in variant no-adc)
R27  2k2  R-US_R0603  [R0603]  (not fitted in variant no-adc)
R28  2k2  R-US_R0603  [R0603]  (not fitted in variant no-adc)
R29  36R, 0.5%  R-US_R0603  [R0603]  (not fitted in variant no-adc)
R30  36R, 0.5%  R-US_R0603  [R0603]  (not fitted in variant no-adc)
T1  TC1-1T  [AT224-1A]  (not fitted in variant no-adc)
U1  AD9215BRUZ  [TSSOP28]  (not fitted in variant no-adc)
U2  AD8331  [QSOP20]  (not fitted in variant no-adc)
U3  LP3985IM5-3.0  V_REG_LDOSMD  [SOT23-5]  (not fitted in variant no-adc)
U4  LTC3200ES6  [SOT23-6L]  (not fitted in variant no-adc)
X1  SMA-142-0711-821/826  [J502-ND-142-0711-821/826]  (not fitted in variant no-adc)
X2  SMA-142-0711-821/826  [J502-ND-142-0711-821/826]  (not fitted in variant no-adc)

### Nets
+3V3 [power]: C28.1 C29.1 L5.1 L9.2 U1.24(DRVDD) ; also sheet 1,2,3,6,7,8
ADC_VCC: C31.1 C32.1 C34.1 C35.1 C36.1 R17.2 R19.1 R24.2 U1.7(AVDD) U1.12(AVDD) U3.5(OUT)
GND [power]: C18.2 C19.2 C20.2 C21.2 C22.1 C24.2 C25.2 C26.2 C27.2 C28.2 C29.2 C30.1 C31.2 C32.2 C33.2 C34.2 C35.2 C36.2 C39.1 C40.1 C41.1 C42.1 C43.2 C44.2 C45.2 C50.2 C51.2 C52.2 C54.2 C55.2 C56.1 C57.1 C59.1 C61.2 C84.2 C86.1 C87.1 D4.2(C) JP4.3 R18.2 R20.1 R21.2 R23.2 R25.1 R26.1(E) T1.4(P2) U1.8(AGND) U1.11(AGND) U1.14(PDWN) U1.23(DRGND) U2.6(COML) U2.9(MODE) U2.17(COMM) U2.20(COMM) U3.2(GND) U4.2(GND) X1.G@1 X1.G@2 X1.G@3 X1.G@4 X2.G@1 X2.G@2 X2.G@3 X2.G@4 ; also sheet 1,2,3,4,6,7,8
N$6: C44.1 R13.1 R15.2 R19.2 R20.2 U1.9(VIN+)
N$7: C12.2 R15.1
N$8: C15.2 R16.1
N$9: C15.1 U2.16(VOL)
N$11: C12.1 U2.15(VOH)
N$12: C17.2 U2.5(LOP)
N$16: C17.1 U2.7(VIP)
N$18: C16.2 U2.8(VIN)
N$19: C16.1 R22.2 U2.4(LON)
N$21: C18.1 C19.1 U2.11(VCM)
N$22: C20.1 C21.1 R21.1 U2.12(RCLMP)
N$27: C22.2 U2.1(LMD)
N$28: C23.1 C46.1 C61.1 U2.2(INH)
N$29: C23.2 JP3.1
N$30: JP3.2 R22.1
N$31: C26.1 C27.1 L6.2 U2.14(VPOS)
N$55: C30.2 U3.4(BP)
N$56: C33.1 L5.2 U3.1(IN) U3.3(EN)
N$57: C37.1 C38.1 C39.2 U1.5(REFB)
N$58: C37.2 C38.2 C40.2 U1.6(REFT)
N$59: C41.2 C42.2 R26.3(A) U1.4(VREF)
N$60: C45.1 JP4.2 U1.3(SENSE)
N$61: R23.1 R24.1 U1.2(MODE)
N$62: C43.1 R14.1 R16.2 R17.1 R18.1 U1.10(VIN-)
N$63: JP4.1 R26.2(S)
N$64: L7.1 X2.1
N$67: C51.1 R27.2 R28.1
N$68: C52.1 D4.3(A) R28.2 U2.10(GAIN)
N$69: C24.1 C25.1 C50.1 C59.2 L2.2 U2.3(VPSL) U2.18(ENBV) U2.19(ENBL)
N$70: R14.2 R30.1 T1.3(S2)
N$71: C53.2 X1.1
N$72: C53.1 L8.1
N$73: L8.2 T1.6(P1)
N$74: C85.1 U4.4(C-)
N$75: R13.2 R29.2 T1.1(S1)
N$76: C54.1 C55.1 C56.2 C57.2 R29.1 R30.2 T1.2(ST)
N$78: C46.2 L7.2
N$79: C85.2 U4.6(C+)
N$85: C86.2 L9.1 U4.3(!SHDN) U4.5(VIN)
N$86: C84.1 C87.2 L2.1 L6.1 U4.1(VOUT)
OA_ADC0: U1.17(D0) ; also sheet 3
OA_ADC1: U1.18(D1) ; also sheet 3
OA_ADC2: U1.19(D2) ; also sheet 3
OA_ADC3: U1.20(D3) ; also sheet 3
OA_ADC4: U1.21(D4) ; also sheet 3
OA_ADC5: U1.22(D5) ; also sheet 3
OA_ADC6: U1.25(D6) ; also sheet 3
OA_ADC7: U1.26(D7) ; also sheet 3
OA_ADC8: U1.27(D8) ; also sheet 3
OA_ADC9: U1.28(D9) ; also sheet 3
OA_ADCOR: U1.1(OR) ; also sheet 3
OA_CLKADC: R25.2 U1.13(CLK) ; also sheet 3
OA_GAIN: R27.1 ; also sheet 3
OA_HILO: U2.13(HILO) ; also sheet 3
Unconnected: D4.1(CA)

### Buses
ADC[0..9],ADC_OR

### Notes on the sheet
- DNM
- Analog Portion

## Sheet 6 of 8
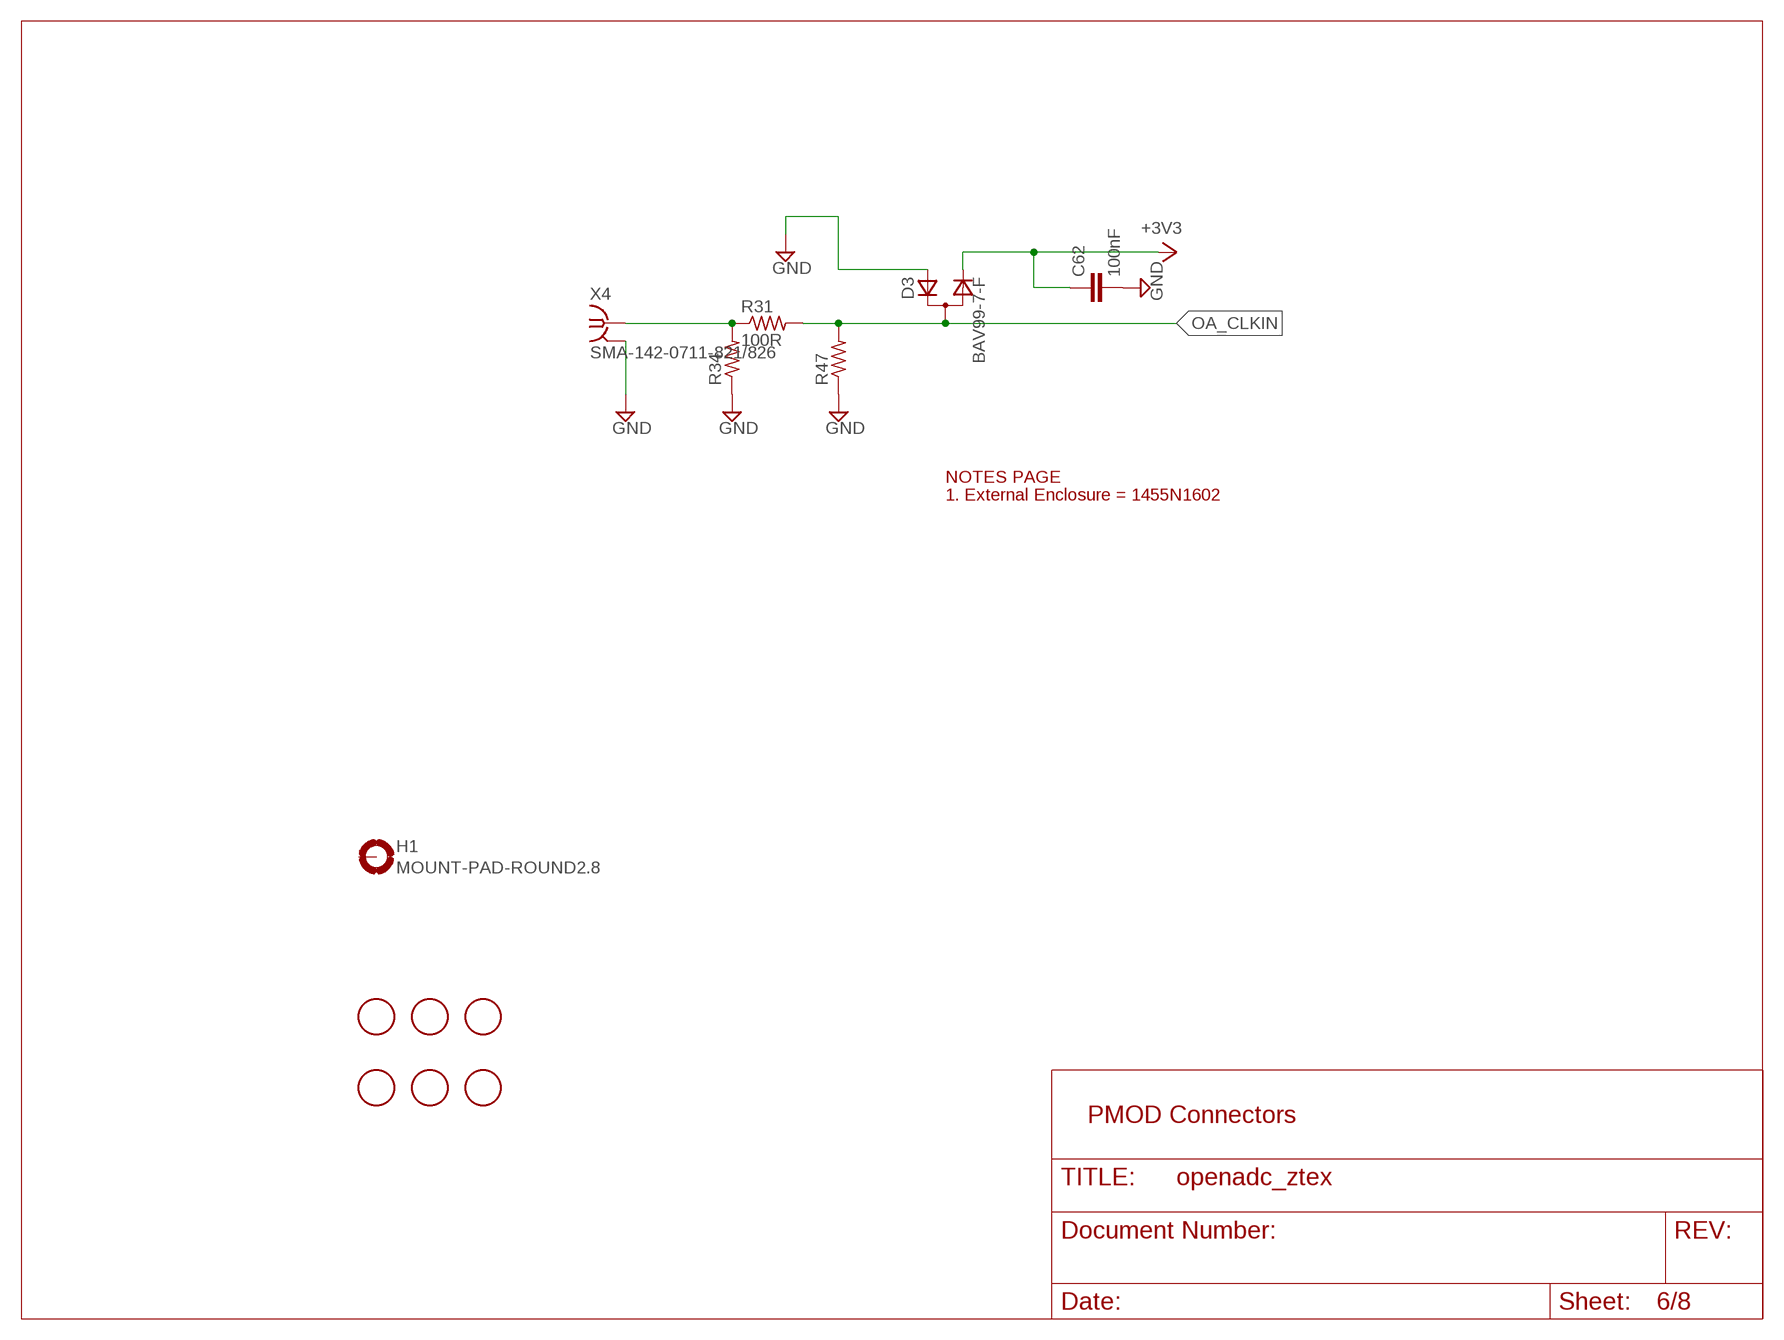
[diagram p5: schematic, sheet 6]

### Parts
C62  100nF  C-EUC0603  [C0603]
D3  BAV99-7-F  D_ACACSOT23  [SOT-23]
FID1  FIDUCIAL  [FIDUCIAL_1MM]
FID2  FIDUCIAL  [FIDUCIAL_1MM]
FID3  FIDUCIAL  [FIDUCIAL_1MM]
FID4  FIDUCIAL  [FIDUCIAL_1MM]
FID5  FIDUCIAL  [FIDUCIAL_1MM]
FID6  FIDUCIAL  [FIDUCIAL_1MM]
H1  MOUNT-PAD-ROUND2.8  [2,8-PAD]  (not fitted in variant no-adc)
R31  100R  R-US_R0805  [R0805]
R34  R-US_R0805  [R0805]  (not fitted in variant no-adc)
R47  R-US_R0805  [R0805]  (not fitted in variant no-adc)
X4  SMA-142-0711-821/826  [J502-ND-142-0711-821/826]

### Nets
+3V3 [power]: C62.1 D3.2(C) ; also sheet 1,2,3,5,7,8
GND [power]: C62.2 D3.3(A) R34.1 R47.1 X4.G@1 X4.G@2 X4.G@3 X4.G@4 ; also sheet 1,2,3,4,5,7,8
N$80: R31.1 R34.2 X4.1
OA_CLKIN: D3.1(CA) R31.2 R47.2 ; also sheet 3
Unconnected: H1.B2,8(MOUNT)

### Notes on the sheet
- NOTES PAGE
- 1. External Enclosure = 1455N1602
- PMOD Connectors

## Sheet 7 of 8
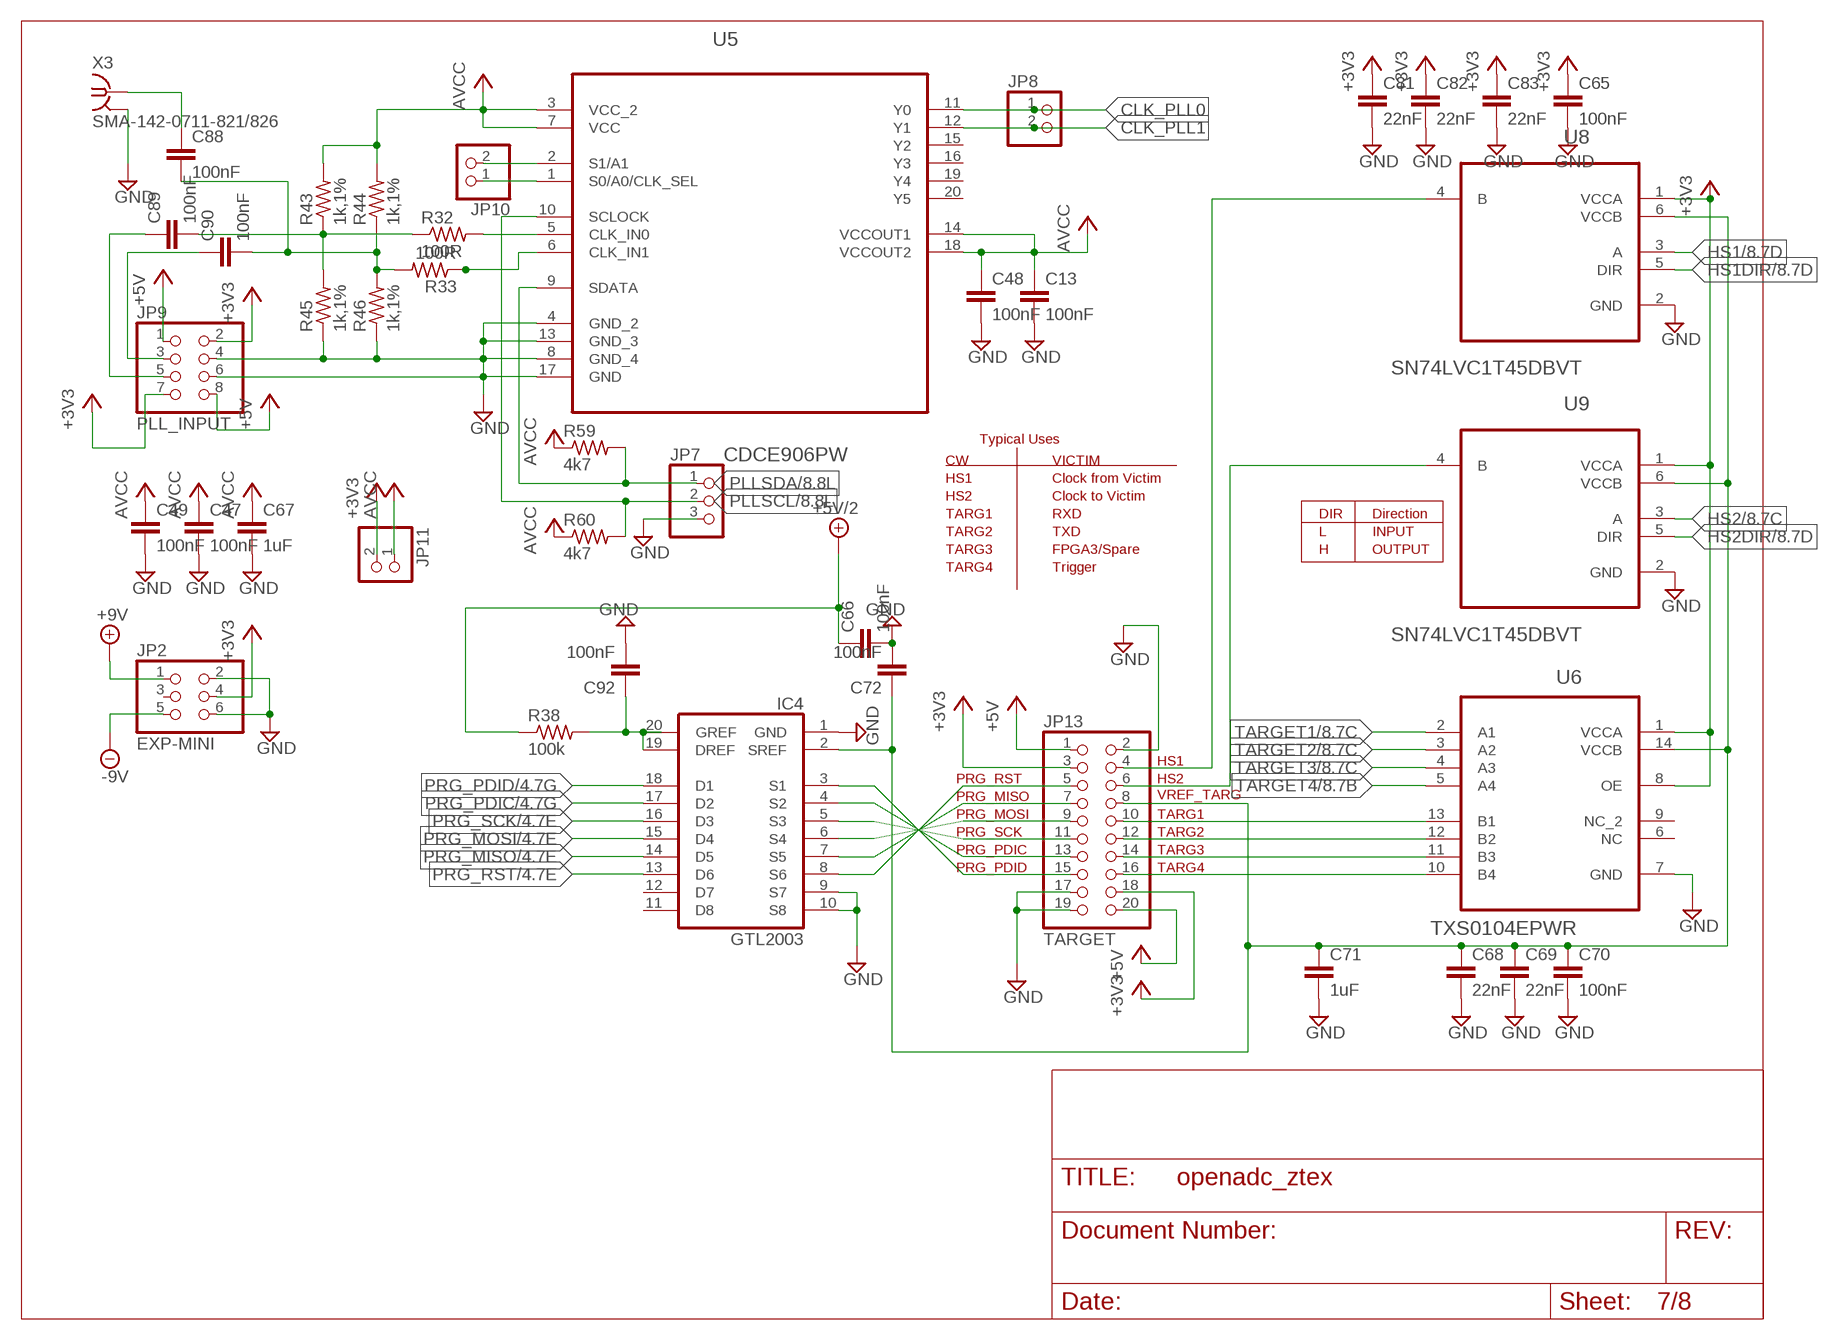
[diagram p6: schematic, sheet 7]

### Parts
C13  100nF  C-EUC0603  [C0603]
C47  100nF  C-EUC0603  [C0603]
C48  100nF  C-EUC0603  [C0603]
C49  100nF  C-EUC0603  [C0603]
C65  100nF  C-EUC0603  [C0603]
C66  100nF  C-EUC0603  [C0603]
C67  1uF  C-EUC0603  [C0603]
C68  22nF  C-EUC0603  [C0603]
C69  22nF  C-EUC0603  [C0603]
C70  100nF  C-EUC0603  [C0603]
C71  1uF  C-EUC0603  [C0603]
C72  100nF  C-EUC0603  [C0603]
C81  22nF  C-EUC0603  [C0603]
C82  22nF  C-EUC0603  [C0603]
C83  22nF  C-EUC0603  [C0603]
C88  100nF  C-EUC0603  [C0603]
C89  100nF  C-EUC0603  [C0603]
C90  100nF  C-EUC0603  [C0603]
C92  100nF  C-EUC0603  [C0603]
IC4  GTL2003  [TSSOP20]
JP2  EXP-MINI  PINHD-2X3/90  [2X03/90]
JP7  PINHD-1X3  [1X03]  (not fitted in variant no-adc)
JP8  PINHD-1X2  [1X02]  (not fitted in variant no-adc)
JP9  PLL_INPUT  PINHD-2X4/90  [2X04/90]
JP10  PINHD-1X2  [1X02]  (not fitted in variant no-adc)
JP11  PINHD-1X2  [1X02]
JP13  TARGET  PINHD-2X10/90  [2X10/90]
R32  100R  R-US_R0603  [R0603]
R33  100R  R-US_R0603  [R0603]
R38  100k  R-US_R0603  [R0603]
R43  1k,1%  R-US_R0603  [R0603]
R44  1k,1%  R-US_R0603  [R0603]
R45  1k,1%  R-US_R0603  [R0603]
R46  1k,1%  R-US_R0603  [R0603]
R59  4k7  R-US_R0603  [R0603]
R60  4k7  R-US_R0603  [R0603]
U5  CDCE906PW  [SOP65P640X120-20N]
U6  TXS0104EPWR  TXB0104PWR  [SOP65P640X120-14N]
U8  SN74LVC1T45DBVT  [SOT95P280X145-6N]
U9  SN74LVC1T45DBVT  [SOT95P280X145-6N]
X3  SMA-142-0711-821/826  [J502-ND-142-0711-821/826]

### Nets
+3V3 [power]: C65.1 C81.1 C82.1 C83.1 JP2.4 JP9.2 JP9.7 JP11.2 JP13.3 JP13.18 U6.1(VCCA) U6.8(OE) U8.1(VCCA) U9.1(VCCA) ; also sheet 1,2,3,5,6,8
+5V: JP9.1 JP9.8 JP13.1 JP13.20 ; also sheet 1,2,8
+5V/2: C66.1 R38.1 ; also sheet 1,4
+9V: JP2.1 ; also sheet 1
-9V: JP2.5 ; also sheet 1
AVCC [power]: C13.1 C47.1 C48.1 C49.1 C67.1 JP11.1 R43.2 R44.2 R59.1 R60.1 U5.3(VCC_2) U5.7(VCC) U5.14(VCCOUT1) U5.18(VCCOUT2)
CLK_PLL0: JP8.1 U5.11(Y0) ; also sheet 3
CLK_PLL1: JP8.2 U5.12(Y1) ; also sheet 3
GND [power]: C13.2 C47.2 C48.2 C49.2 C65.2 C66.2 C67.2 C68.2 C69.2 C70.2 C71.2 C72.2 C81.2 C82.2 C83.2 C92.2 IC4.1(GND) IC4.9(S7) IC4.10(S8) JP2.2 JP2.6 JP7.3 JP9.4 JP9.6 JP13.2 JP13.17 JP13.19 R45.1 R46.1 U5.4(GND_2) U5.8(GND_4) U5.13(GND_3) U5.17(GND) U6.7(GND) U8.2(GND) U9.2(GND) X3.G@1 X3.G@2 X3.G@3 X3.G@4 ; also sheet 1,2,3,4,5,6,8
HS1: U8.3(A) ; also sheet 8
HS1DIR: U8.5(DIR) ; also sheet 8
HS2: U9.3(A) ; also sheet 8
HS2DIR: U9.5(DIR) ; also sheet 8
N$65: C89.1 JP9.5
N$66: C90.1 JP9.3
N$77: C89.2 R32.1 R43.1 R45.2
N$81: C88.2 C90.2 R33.2 R44.1 R46.2
N$83: C92.1 IC4.19(DREF) IC4.20(GREF) R38.2
N$84: R33.1 U5.6(CLK_IN1)
N$87: IC4.8(S6) JP13.5
N$89: JP13.16 U6.10(B4)
N$90: JP13.14 U6.11(B3)
N$91: JP13.12 U6.12(B2)
N$92: JP13.10 U6.13(B1)
N$93: C68.1 C69.1 C70.1 C71.1 C72.1 IC4.2(SREF) JP13.8 U6.14(VCCB) U8.6(VCCB) U9.6(VCCB)
N$94: IC4.7(S5) JP13.7
N$95: IC4.6(S4) JP13.9
N$96: IC4.5(S3) JP13.11
N$97: IC4.4(S2) JP13.13
N$98: IC4.3(S1) JP13.15
N$100: JP13.6 U9.4(B)
N$101: JP13.4 U8.4(B)
N$118: C88.1 X3.1
N$119: JP10.2 U5.2(S1/A1)
N$120: JP10.1 U5.1(S0/A0/CLK_SEL)
N$125: R32.2 U5.5(CLK_IN0)
PLLSCL: JP7.2 R60.2 U5.10(SCLOCK) ; also sheet 8
PLLSDA: JP7.1 R59.2 U5.9(SDATA) ; also sheet 8
PRG_MISO: IC4.14(D5) ; also sheet 4
PRG_MOSI: IC4.15(D4) ; also sheet 4
PRG_PDIC: IC4.17(D2) ; also sheet 4
PRG_PDID: IC4.18(D1) ; also sheet 4
PRG_RST: IC4.13(D6) ; also sheet 4
PRG_SCK: IC4.16(D3) ; also sheet 4
TARGET1: U6.2(A1) ; also sheet 8
TARGET2: U6.3(A2) ; also sheet 8
TARGET3: U6.4(A3) ; also sheet 8
TARGET4: U6.5(A4) ; also sheet 8
Unconnected: IC4.11(D8) IC4.12(D7) JP2.3 U5.15(Y2) U5.16(Y3) U5.19(Y4) U5.20(Y5) U6.6(NC) U6.9(NC_2)

### Notes on the sheet
- Typical Uses
- CW | VICTIM
- HS1 | Clock from Victim
- HS2 | Clock to Victim
- TARG1 | RXD | DIR | Direction
- TARG2 | TXD | L | INPUT
- TARG3 | FPGA3/Spare | H | OUTPUT
- TARG4 | Trigger
- HS1
- PRG_RST | HS2
- PRG_MISO | VREF_TARG
- PRG_MOSI | TARG1
- PRG_SCK | TARG2
- PRG_PDIC | TARG3
- PRG_PDID | TARG4

## Sheet 8 of 8
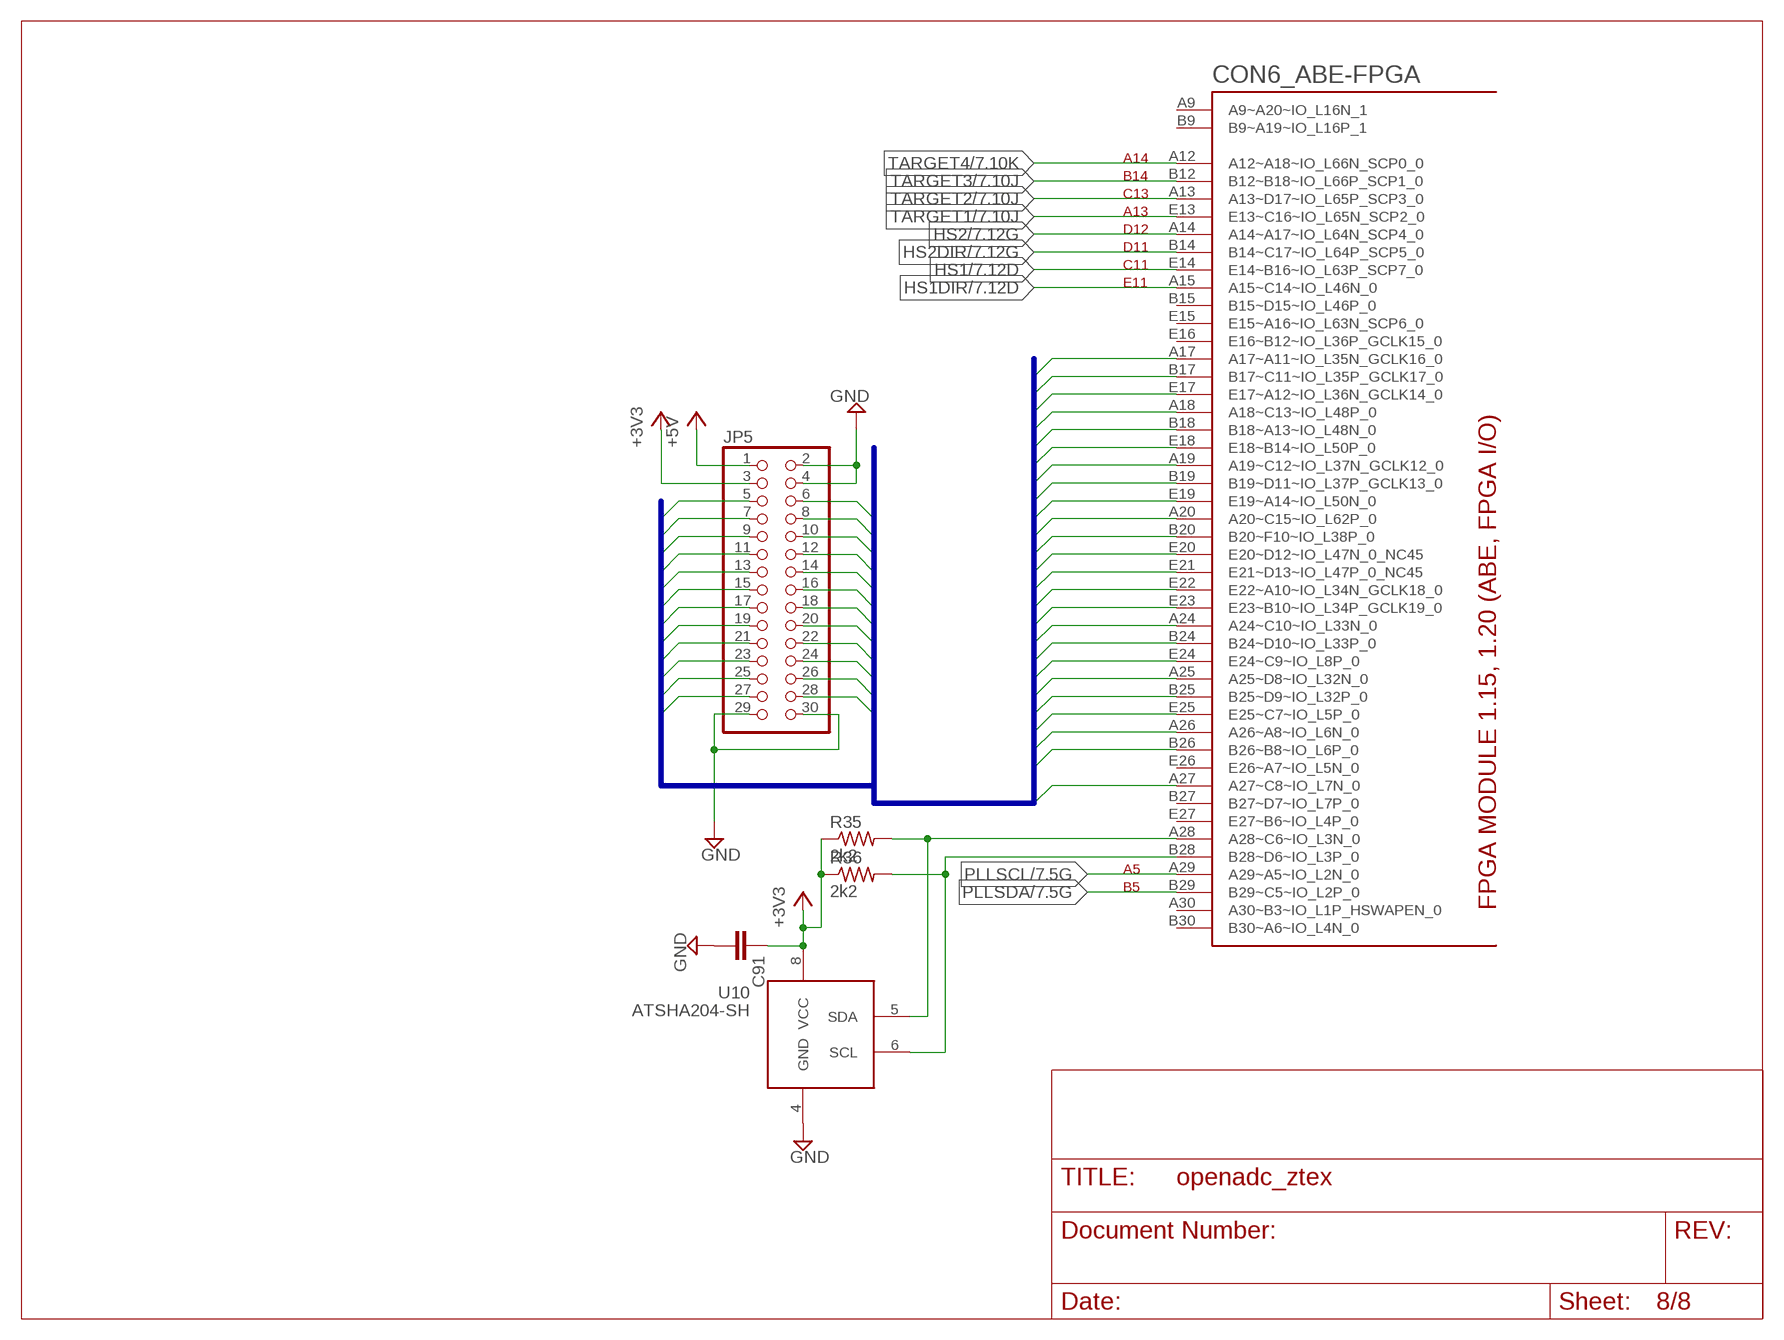
[diagram p7: schematic, sheet 8]

### Parts
C91  C-EUC0603  [C0603]
JP5  PINHD-2X15/90  [2X15/90]
R35  2k2  R-US_R0603  [R0603]
R36  2k2  R-US_R0603  [R0603]
U10  ATSHA204-SH  [SO08]

### Nets
+3V3 [power]: C91.1 JP5.3 R35.1 R36.1 U10.8(VCC) ; also sheet 1,2,3,5,6,7
+5V: JP5.1 ; also sheet 1,2,7
EXPIO5: CON6.A27(_ABE-FPGA:A27~C8~IO_L7N_0) JP5.5
EXPIO6: CON6.B26(_ABE-FPGA:B26~B8~IO_L6P_0) JP5.6
EXPIO7: CON6.A26(_ABE-FPGA:A26~A8~IO_L6N_0) JP5.7
EXPIO8: CON6.A25(_ABE-FPGA:A25~D8~IO_L32N_0) JP5.8
EXPIO9: CON6.B25(_ABE-FPGA:B25~D9~IO_L32P_0) JP5.9
EXPIO10: CON6.E25(_ABE-FPGA:E25~C7~IO_L5P_0) JP5.10
EXPIO11: CON6.A24(_ABE-FPGA:A24~C10~IO_L33N_0) JP5.11
EXPIO12: CON6.B24(_ABE-FPGA:B24~D10~IO_L33P_0) JP5.12
EXPIO13: CON6.E24(_ABE-FPGA:E24~C9~IO_L8P_0) JP5.13
EXPIO14: CON6.E23(_ABE-FPGA:E23~B10~IO_L34P_GCLK19_0) JP5.14
EXPIO15: CON6.E22(_ABE-FPGA:E22~A10~IO_L34N_GCLK18_0) JP5.15
EXPIO16: CON6.E21(_ABE-FPGA:E21~D13~IO_L47P_0_NC45) JP5.16
EXPIO17: CON6.E20(_ABE-FPGA:E20~D12~IO_L47N_0_NC45) JP5.17
EXPIO18: CON6.B20(_ABE-FPGA:B20~F10~IO_L38P_0) JP5.18
EXPIO19: CON6.A20(_ABE-FPGA:A20~C15~IO_L62P_0) JP5.19
EXPIO20: CON6.E19(_ABE-FPGA:E19~A14~IO_L50N_0) JP5.20
EXPIO21: CON6.B19(_ABE-FPGA:B19~D11~IO_L37P_GCLK13_0) JP5.21
EXPIO22: CON6.A19(_ABE-FPGA:A19~C12~IO_L37N_GCLK12_0) JP5.22
EXPIO23: CON6.A18(_ABE-FPGA:A18~C13~IO_L48P_0) JP5.23
EXPIO24: CON6.B18(_ABE-FPGA:B18~A13~IO_L48N_0) JP5.24
EXPIO25: CON6.E18(_ABE-FPGA:E18~B14~IO_L50P_0) JP5.25
EXPIO26: CON6.B17(_ABE-FPGA:B17~C11~IO_L35P_GCLK17_0) JP5.26
EXPIO27: CON6.A17(_ABE-FPGA:A17~A11~IO_L35N_GCLK16_0) JP5.27
EXPIO28: CON6.E17(_ABE-FPGA:E17~A12~IO_L36N_GCLK14_0) JP5.28
GND [power]: C91.2 JP5.2 JP5.4 JP5.29 JP5.30 U10.4(GND) ; also sheet 1,2,3,4,5,6,7
HS1: CON6.E14(_ABE-FPGA:E14~B16~IO_L63P_SCP7_0) ; also sheet 7
HS1DIR: CON6.A15(_ABE-FPGA:A15~C14~IO_L46N_0) ; also sheet 7
HS2: CON6.A14(_ABE-FPGA:A14~A17~IO_L64N_SCP4_0) ; also sheet 7
HS2DIR: CON6.B14(_ABE-FPGA:B14~C17~IO_L64P_SCP5_0) ; also sheet 7
N$121: CON6.B28(_ABE-FPGA:B28~D6~IO_L3P_0) R36.2 U10.6(SCL)
N$124: CON6.A28(_ABE-FPGA:A28~C6~IO_L3N_0) R35.2 U10.5(SDA)
PLLSCL: CON6.A29(_ABE-FPGA:A29~A5~IO_L2N_0) ; also sheet 7
PLLSDA: CON6.B29(_ABE-FPGA:B29~C5~IO_L2P_0) ; also sheet 7
TARGET1: CON6.E13(_ABE-FPGA:E13~C16~IO_L65N_SCP2_0) ; also sheet 7
TARGET2: CON6.A13(_ABE-FPGA:A13~D17~IO_L65P_SCP3_0) ; also sheet 7
TARGET3: CON6.B12(_ABE-FPGA:B12~B18~IO_L66P_SCP1_0) ; also sheet 7
TARGET4: CON6.A12(_ABE-FPGA:A12~A18~IO_L66N_SCP0_0) ; also sheet 7
Unconnected: CON6.A9(_ABE-FPGA:A9~A20~IO_L16N_1) CON6.A30(_ABE-FPGA:A30~B3~IO_L1P_HSWAPEN_0) CON6.B9(_ABE-FPGA:B9~A19~IO_L16P_1) CON6.B15(_ABE-FPGA:B15~D15~IO_L46P_0) CON6.B27(_ABE-FPGA:B27~D7~IO_L7P_0) CON6.B30(_ABE-FPGA:B30~A6~IO_L4N_0) CON6.E15(_ABE-FPGA:E15~A16~IO_L63N_SCP6_0) CON6.E16(_ABE-FPGA:E16~B12~IO_L36P_GCLK15_0) CON6.E26(_ABE-FPGA:E26~A7~IO_L5N_0) CON6.E27(_ABE-FPGA:E27~B6~IO_L4P_0)

### Buses
EXPIO[0..30]

### Notes on the sheet
- A14
- B14
- C13
- A13
- D12
- D11
- C11
- E11
- A5
- B5

## Library data of the parts
C1-C11 C63 C64 = myrcl:C-EU: CAPACITOR, European symbol
C12 C13 C15-C17 C41 C43 C44 C46-C49 C51-C53 C65-C73 C76-C83 C88-C90 C92 = rcl:C-EU: CAPACITOR, European symbol
C14 = myrcl:CPOL-EU: POLARIZED CAPACITOR, European symbol
C18 C20 C25 C27 C54 C56 = rcl:C-EU: CAPACITOR, European symbol; DIGIKEY#: 445-4924-1-ND; PART#: C1005X7R1E102K
C19 C21 C22 C24 C26 C28 C32 C36 C38-C40 C42 C45 C50 C55 C57 = rcl:C-EU: CAPACITOR, European symbol; DIGIKEY#: 490-1318-1-ND; PART#: GRM155R61A104KA01D
C23 C61 = rcl:C-EU: CAPACITOR, European symbol; DIGIKEY#: 587-1099-1-ND; MANF#: LMK107SD183JA-T
C29 = rcl:C-EU: CAPACITOR, European symbol; DIGIKEY#: 490-1312-1-ND; MANF#: GRM155R71E103KA01D
C30 = rcl:C-EU: CAPACITOR, European symbol; DIGIKEY#: 445-2664-1-ND
C31 C35 = rcl:C-EU: CAPACITOR, European symbol; DIGIKEY#: 490-1312-1-ND; DIIGKEY#: 490-1312-1-ND; MANF#: GRM155R71E103KA01D; PART#: GRM155R71E103KA01D
C33 C34 C59 C84-C87 = rcl:C-EU: CAPACITOR, European symbol; DIGIKEY#: 490-1543-1-ND; PART#: GRM188R61A105KA61D
C37 = rcl:C-EU: CAPACITOR, European symbol; DIGIKEY#: C1608X5R0J106K
C58 C60 C74 C75 C91 = resistor:C-EU: CAPACITOR, European symbol
C62 = adc_microboard:C-EU: CAPACITOR, European symbol
CHANNEL1 CHANNEL2 = openadc_footprint:OPENADC
CON3 = xlinix:JTAG
CON6 = usb-fpga-1:USB-FPGA1.15
D1 = diode:DIODE-: DIODE
D3 D4 = zetex:D_ACAC: Dual DIODE; OC_FARNELL: unknown; OC_NEWARK: unknown
DC1 = dc-dc-converter:NMA: DC-DC CONVERTER; MF: C & D TECHNOLOGIES, INC; MPN: NMA0515SC; OC_FARNELL: 1021434; OC_NEWARK: 61K3064
FID1-FID6 = adafruit:FIDUCIAL: For use by pick and place machines to calibrate the vision/machine, 1mm By microbuilder.eu
H1 = holes:MOUNT-PAD-ROUND: MOUNTING PAD, round
IC1 IC2 = mystuff:AOZ1021
IC3 = mystuff:AOZ1094
IC4 = manekinen_diy:GTL2003: "8-bit bidirectional low voltage translator"
IC5 = adafruit:AT90USB162: MICROCONTROLLER 8 Kbytes FLASH 1 kbytes SRAM 512 bytes EEPROM USART 6-channel 10 bit ADC 2-channel 8 bit ADC
IC6 = v-reg:LM337L: VOLTAGE REGULATOR
IC7 = v-reg:LM317L: VOLTAGE REGULATOR
JP1 JP6 JP8 JP10 JP11 = pinhead:PINHD-1X2: PIN HEADER
JP2 = pinhead:PINHD-2X3: PIN HEADER
JP3 = SparkFun:JUMPER-2: Jumper Basic 0.1" spaced jumper. Use with breakaway headers.
JP4 = SparkFun:JUMPER-3
JP5 = pinhead:PINHD-2X15: PIN HEADER
JP7 = pinhead:PINHD-1X3: PIN HEADER
JP9 = pinhead:PINHD-2X4: PIN HEADER
JP13 = pinhead:PINHD-2X10: PIN HEADER
L1 L4 = myrcl:L-EU: INDUCTOR, European symbol; DIGIKEY#: 587-2100-1-ND
L2 = SparkFun:INDUCTOR: Inductors Basic Inductor/Choke - 0603 and 1206. Footprints are not proven and vary greatly between part numbers.; DIGIKEY#: 445-6234-1-ND; PART#: MLF1608DR12M
L3 = inductors:DR1030: DR1030 Series Low Profile Power Inductors Source: Data sheet <http://www.cooperbussmann.com/pdf/c73e479f-f867-4c64-ae26-9c1f23814163.pdf>; MPN: CDRH104RNP-2R5NC
L5-L9 = SparkFun:INDUCTOR: Inductors Basic Inductor/Choke - 0603 and 1206. Footprints are not proven and vary greatly between part numbers.
LED1-LED12 = dp_devices:LED: Light Emitting Diode
R1-R12 = myrcl:R-EU_: RESISTOR, European symbol
R13 = adafruit:R-US_: RESISTOR, American symbol; DIGIKEY#: RR08Q33DCT-ND
R14-R16 R18-R21 R23-R25 R27 R28 R31 R34 R47 = adafruit:R-US_: RESISTOR, American symbol
R17 = adafruit:R-US_: RESISTOR, American symbol; DIGIKEY#: RHM1.00KCDCT-ND
R22 = adafruit:R-US_: RESISTOR, American symbol; DIGIKEY#: RR08P274DCT-ND
R26 = customs:TRIM_US-: POTENTIOMETER; DIGIKEY#: 3361P-203GLFCT-ND; PART#: 3361P-1-203GLF
R29 R30 = adafruit:R-US_: RESISTOR, American symbol; DIGIKEY#: RR08Q36DCT-ND
R32 R33 R35-R46 R48-R61 = resistor:R-US_: RESISTOR, American symbol
SJ1 SJ2 = jumper:SJ: SMD solder JUMPER
T1 = customs:TC1-1T
TP1 TP2 = testpad:TPSQ: Test pad
TP3-TP9 = testpad:PTR1: TEST PIN
U1 = customs:AD9215BRUZ; DIGIKEY#: AD9215BRUZ-105-ND
U2 = customs:AD8331; DIGIKEY#: AD8331ARQZ-ND; PART#: AD8331ARQZ
U3 = SparkFun:V_REG_LDO: Voltage Regulator LDO Standard 150mA LDO voltage regulator in SOT-23 layout. Micrel part MIC5205. BP (by-pass) pin is used to lower output noise with 470pF cap.; DIGIKEY#: LP3985IM5-3.0CT-ND
U4 = customs:LTC3200
U5 = Texas Instruments_By_element14_Batch_1:CDCE906PW: PROGRAMMABLE 3-PLL CLOCK SYNTHESIZER / MULTIPLIER / DIVIDER; MPN: CDCE906PW; OC_FARNELL: 1791641; OC_NEWARK: 06M7226; PACKAGE: TSSOP-20; SUPPLIER: Texas Instruments
U6 = Texas Instruments_By_element14_Batch_1:TXB0104PWR: 4-BIT BIDIRECTIONAL VOLTAGE-LEVEL TRANSLATOR; MPN: TXB0104PWR; OC_FARNELL: 1607891; OC_NEWARK: 99K4466; PACKAGE: TSSOP-14; SUPPLIER: Texas Instruments
U8 U9 = Texas Instruments_By_element14_Batch_1:SN74LVC1T45DBVT: BUS Transceiver; MPN: SN74LVC1T45DBVT; OC_FARNELL: 1470916; OC_NEWARK: 01J0796; PACKAGE: SOT-23; SUPPLIER: Texas Instruments
U10 = customs:ATSHA204-SH
X1-X4 = con-coax:SMA-: SMA 50 Ohm End Launch Jack Receptacle - Round Contact Johnson Components Source: www.johnsoncomponents.com .. J502-ND.pdf; MF: JOHNSON COMPONENTS; MPN: 142-0711-821; OC_FARNELL: 1019328; OC_NEWARK: 16F3627
X5 = con-berg:PN61729-S: BERG USB connector; OC_FARNELL: unknown; OC_NEWARK: unknown
XTAL1 = dp_devices:OSC-XTAL